# Altium project Artix7BasedBatDetector.PrjPcb
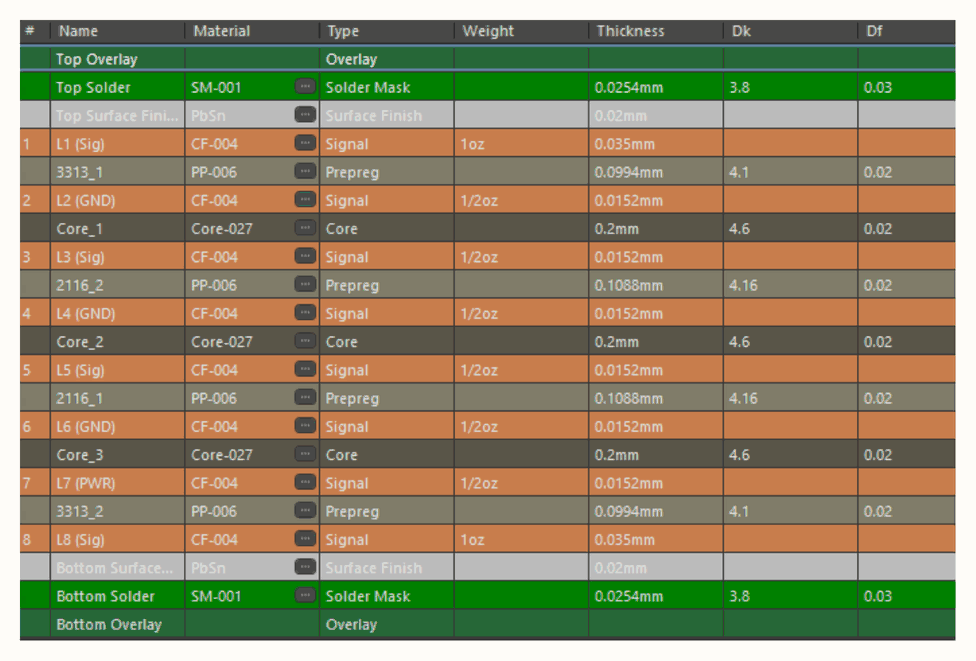
[diagram p0: ImpedanceControl.SchDoc]
11 sheets, 232 parts. Net scope: global (net labels, ports and power ports of the same name join across sheets).
Board file: PCBDesign.PcbDoc
Sheets:
  ImpedanceControl.SchDoc
  PowerSupplies.SchDoc
  FPGADecoupling.SchDoc
  FPGAConfig.SchDoc
  FTDIJtagConversion.SchDoc
  USBULPI.SchDoc
  FPGABank1X.SchDoc
  FPGABank3X.SchDoc
  DDR2Module.SchDoc
  AudioADC.SchDoc
  AnalogFrontend.SchDoc

## Sheet ImpedanceControl.SchDoc
size A4; SheetNumber: 1; SheetTotal: 11

## Sheet PowerSupplies.SchDoc
size A4; SheetNumber: 1; SheetTotal: 10
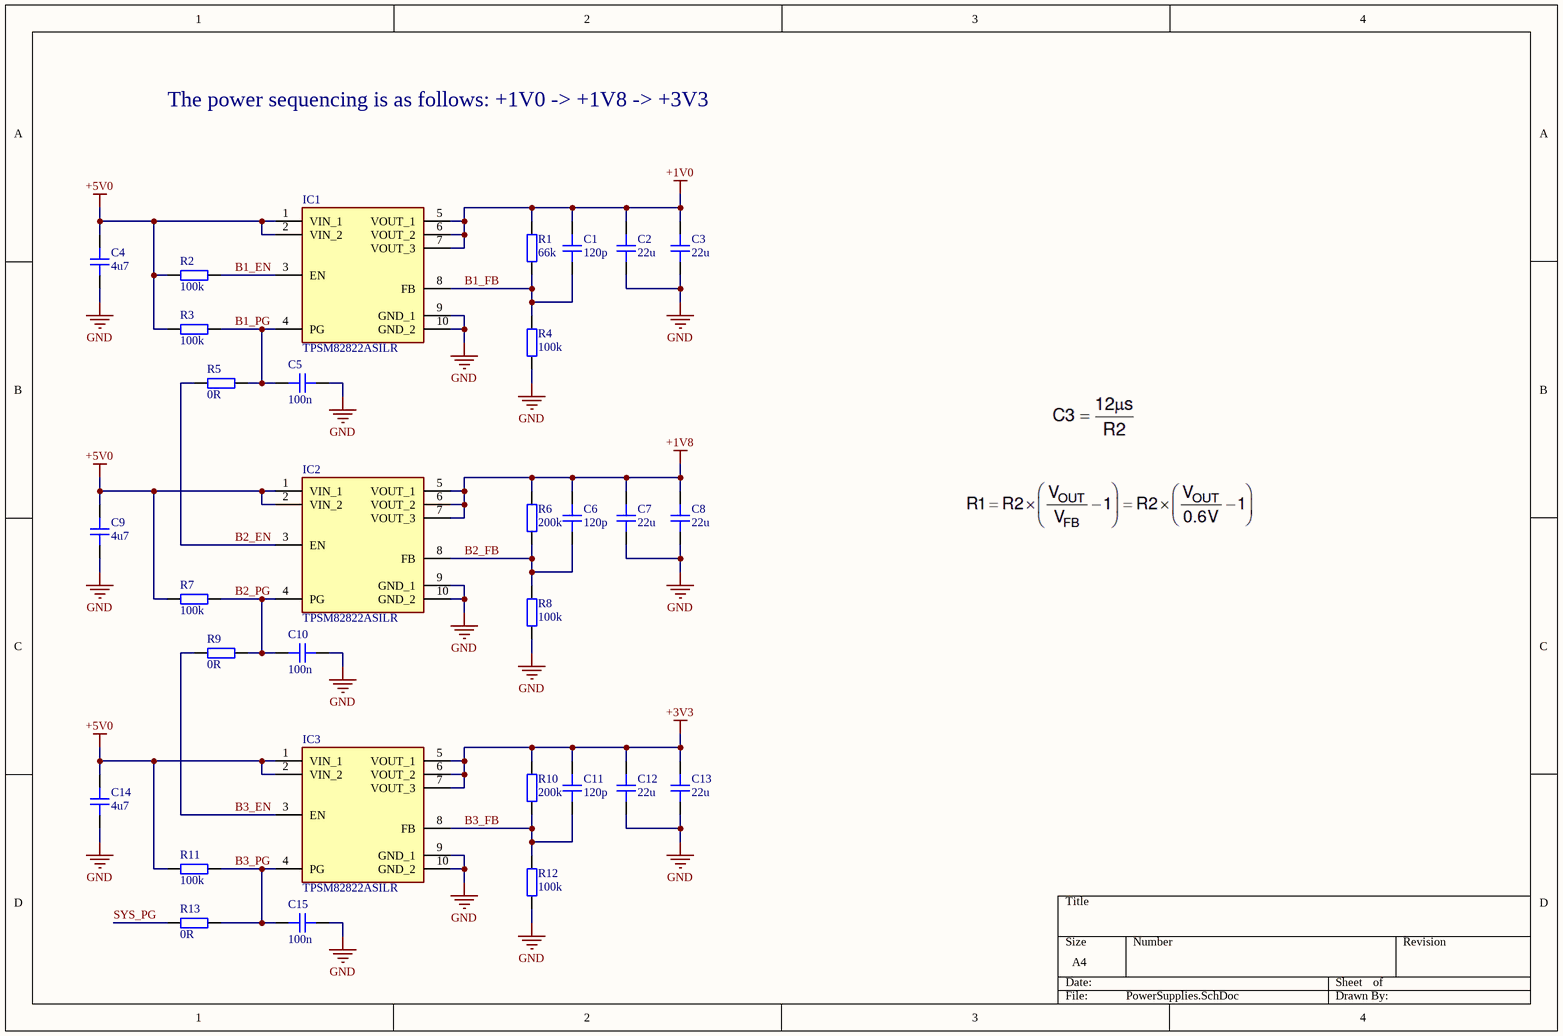
[diagram p1: PowerSupplies.SchDoc]

### Parts
C1  120p  [CAP_0402]
C2  22u  [CAP_0603]
C3  22u  [CAP_0603]
C4  4u7  [CAP_0402]
C5  100n  [CAP_0402]
C6  120p  [CAP_0402]
C7  22u  [CAP_0603]
C8  22u  [CAP_0603]
C9  4u7  [CAP_0402]
C10  100n  [CAP_0402]
C11  120p  [CAP_0402]
C12  22u  [CAP_0603]
C13  22u  [CAP_0603]
C14  4u7  [CAP_0402]
C15  100n  [CAP_0402]
IC1  TPSM82822ASILR  [TPSM82822ASILR]
IC2  TPSM82822ASILR  [TPSM82822ASILR]
IC3  TPSM82822ASILR  [TPSM82822ASILR]
R1  66k  [RES_0402]
R2  100k  [RES_0402]
R3  100k  [RES_0402]
R4  100k  [RES_0402]
R5  0R  [RES_0402]
R6  200k  [RES_0402]
R7  100k  [RES_0402]
R8  100k  [RES_0402]
R9  0R  [RES_0402]
R10  200k  [RES_0402]
R11  100k  [RES_0402]
R12  100k  [RES_0402]
R13  0R  [RES_0402]

### Nets
+1V0: C1.2 C2.2 C3.2 IC1.5(VOUT_1) IC1.6(VOUT_2) IC1.7(VOUT_3) R1.2
+1V8: C6.2 C7.2 C8.2 IC2.5(VOUT_1) IC2.6(VOUT_2) IC2.7(VOUT_3) R6.2
+3V3: C11.2 C12.2 C13.2 IC3.5(VOUT_1) IC3.6(VOUT_2) IC3.7(VOUT_3) R10.2
+5V0: C4.2 C9.2 C14.2 IC1.1(VIN_1) IC1.2(VIN_2) IC2.1(VIN_1) IC2.2(VIN_2) IC3.1(VIN_1) IC3.2(VIN_2) R2.1 R3.1 R7.1 R11.1
GND: C2.1 C3.1 C4.1 C5.1 C7.1 C8.1 C9.1 C10.1 C12.1 C13.1 C14.1 C15.1 IC1.9(GND_1) IC1.10(GND_2) IC2.9(GND_1) IC2.10(GND_2) IC3.9(GND_1) IC3.10(GND_2) R4.1 R8.1 R12.1
B1_EN: IC1.3(EN) R2.2
B1_FB: C1.1 IC1.8(FB) R1.1 R4.2
B1_PG: C5.2 IC1.4(PG) R3.2 R5.2
B2_EN: IC2.3(EN) R5.1
B2_FB: C6.1 IC2.8(FB) R6.1 R8.2
B2_PG: C10.2 IC2.4(PG) R7.2 R9.2
B3_EN: IC3.3(EN) R9.1
B3_FB: C11.1 IC3.8(FB) R10.1 R12.2
B3_PG: C15.2 IC3.4(PG) R11.2 R13.2
SYS_PG: R13.1

### Notes on the sheet
- The power sequencing is as follows: +1V0 -> +1V8 -> +3V3

### Library data of the parts
C1 C4-C6 C9-C11 C14 C15 = CAP_0402: Capacitor SMD 0402; Manufacturer: *; Manufacturer Part Number: *; Distributor Link: *; LCSC: *; Rating: *; Dielectric: *
C2 C3 C7 C8 C12 C13 = CAP_0603: Capacitor SMD 0603; Manufacturer: *; Manufacturer Part Number: *; Distributor Link: *; LCSC: *; Rating: *; Dielectric: *
IC1-IC3 = TPSM82822ASILR: Integrated Circuit; Manufacturer_Name: Texas Instruments; Datasheet Link: https://www.ti.com/lit/ds/symlink/tpsm82821a.pdf?ts=1639463145334&ref_url=https%253A%252F%252Fwww.ti.com%252Fsitesearch%252Fdocs%252Funiversalsearch.tsp%253FlangPref%253Den-US%2526searchTerm%253DTPSM82821ASILR%2526nr%253D8; Height: 1.1mm; Manufacturer_Part_Number: TPSM82822ASILR; Mouser Part Number: 595-TPSM82822ASILR; Mouser Price/Stock: https://www.mouser.co.uk/ProductDetail/Texas-Instruments/TPSM82822ASILR?qs=Rp5uXu7WBW%252BPqUf1%252BNZZyw%3D%3D; Arrow Part Number: TPSM82822ASILR; Arrow Price/Stock: https://www.arrow.com/en/products/tpsm82822asilr/texas-instruments?region=nac
R1-R13 = RES_0402: Resistor SMD 0402; Manufacturer: *; Manufacturer Part Number: *; Distributor Link: *; LCSC: *

## Sheet FPGADecoupling.SchDoc
size A4; SheetNumber: 2; SheetTotal: 10
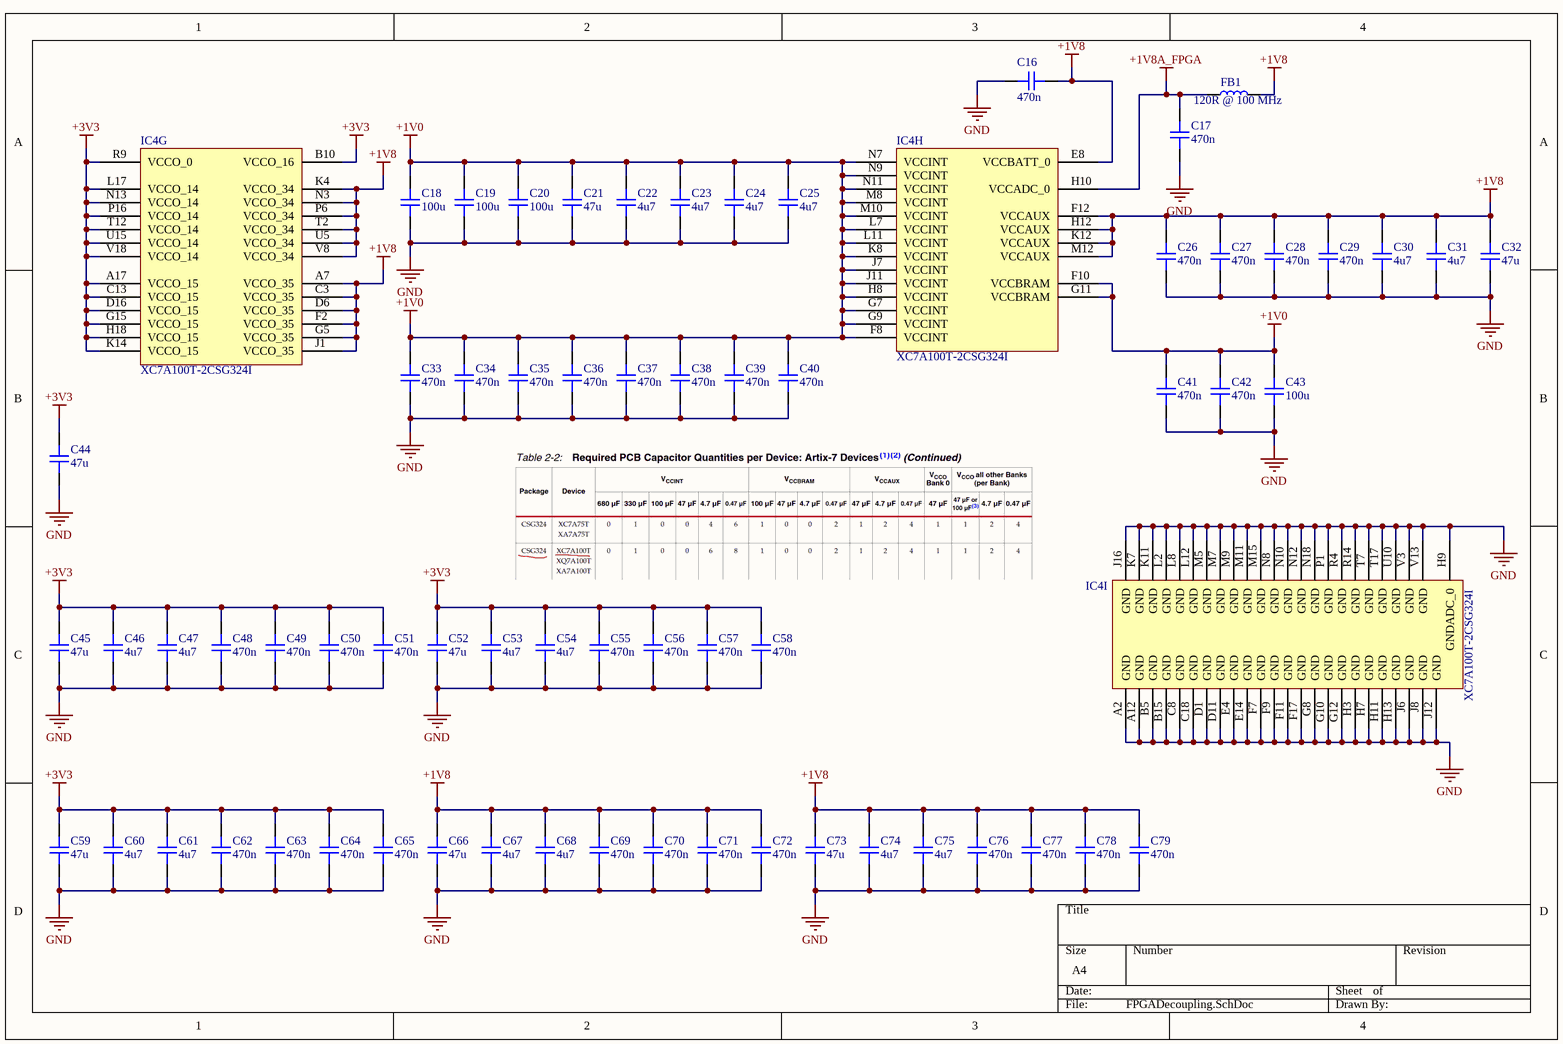
[diagram p2: FPGADecoupling.SchDoc]

### Parts
C16  470n  [CAP_0201]
C17  470n  [CAP_0201]
C18  100u  [CAP_0805]
C19  100u  [CAP_0805]
C20  100u  [CAP_0805]
C21  47u  [CAP_0603]
C22  4u7  [CAP_0402]
C23  4u7  [CAP_0402]
C24  4u7  [CAP_0402]
C25  4u7  [CAP_0402]
C26  470n  [CAP_0201]
C27  470n  [CAP_0201]
C28  470n  [CAP_0201]
C29  470n  [CAP_0201]
C30  4u7  [CAP_0402]
C31  4u7  [CAP_0402]
C32  47u  [CAP_0603]
C33  470n  [CAP_0201]
C34  470n  [CAP_0201]
C35  470n  [CAP_0201]
C36  470n  [CAP_0201]
C37  470n  [CAP_0201]
C38  470n  [CAP_0201]
C39  470n  [CAP_0201]
C40  470n  [CAP_0201]
C41  470n  [CAP_0201]
C42  470n  [CAP_0201]
C43  100u  [CAP_0805]
C44  47u  [CAP_0603]
C45  47u  [CAP_0603]
C46  4u7  [CAP_0402]
C47  4u7  [CAP_0402]
C48  470n  [CAP_0201]
C49  470n  [CAP_0201]
C50  470n  [CAP_0201]
C51  470n  [CAP_0201]
C52  47u  [CAP_0603]
C53  4u7  [CAP_0402]
C54  4u7  [CAP_0402]
C55  470n  [CAP_0201]
C56  470n  [CAP_0201]
C57  470n  [CAP_0201]
C58  470n  [CAP_0201]
C59  47u  [CAP_0603]
C60  4u7  [CAP_0402]
C61  4u7  [CAP_0402]
C62  470n  [CAP_0201]
C63  470n  [CAP_0201]
C64  470n  [CAP_0201]
C65  470n  [CAP_0201]
C66  47u  [CAP_0603]
C67  4u7  [CAP_0402]
C68  4u7  [CAP_0402]
C69  470n  [CAP_0201]
C70  470n  [CAP_0201]
C71  470n  [CAP_0201]
C72  470n  [CAP_0201]
C73  47u  [CAP_0603]
C74  4u7  [CAP_0402]
C75  4u7  [CAP_0402]
C76  470n  [CAP_0201]
C77  470n  [CAP_0201]
C78  470n  [CAP_0201]
C79  470n  [CAP_0201]
FB1  120R @ 100 MHz  [IND_0201]
IC4  XC7A100T-2CSG324I  [CSG324]  (parts G,H,I of 9)

### Nets
+1V0: C18.2 C19.2 C20.2 C21.2 C22.2 C23.2 C24.2 C25.2 C33.2 C34.2 C35.2 C36.2 C37.2 C38.2 C39.2 C40.2 C41.2 C42.2 C43.2 IC4.F8(VCCINT) IC4.F10(VCCBRAM) IC4.G7(VCCINT) IC4.G9(VCCINT) IC4.G11(VCCBRAM) IC4.H8(VCCINT) IC4.J7(VCCINT) IC4.J11(VCCINT) IC4.K8(VCCINT) IC4.L7(VCCINT) IC4.L11(VCCINT) IC4.M8(VCCINT) IC4.M10(VCCINT) IC4.N7(VCCINT) IC4.N9(VCCINT) IC4.N11(VCCINT)
+1V8: C16.2 C26.2 C27.2 C28.2 C29.2 C30.2 C31.2 C32.2 C66.2 C67.2 C68.2 C69.2 C70.2 C71.2 C72.2 C73.2 C74.2 C75.2 C76.2 C77.2 C78.2 C79.2 FB1.2 IC4.A7(VCCO_35) IC4.C3(VCCO_35) IC4.D6(VCCO_35) IC4.E8(VCCBATT_0) IC4.F2(VCCO_35) IC4.F12(VCCAUX) IC4.G5(VCCO_35) IC4.H12(VCCAUX) IC4.J1(VCCO_35) IC4.K4(VCCO_34) IC4.K12(VCCAUX) IC4.M12(VCCAUX) IC4.N3(VCCO_34) IC4.P6(VCCO_34) IC4.T2(VCCO_34) IC4.U5(VCCO_34) IC4.V8(VCCO_34)
+1V8A_FPGA: C17.2 FB1.1 IC4.H10(VCCADC_0)
+3V3: C44.2 C45.2 C46.2 C47.2 C48.2 C49.2 C50.2 C51.2 C52.2 C53.2 C54.2 C55.2 C56.2 C57.2 C58.2 C59.2 C60.2 C61.2 C62.2 C63.2 C64.2 C65.2 IC4.A17(VCCO_15) IC4.B10(VCCO_16) IC4.C13(VCCO_15) IC4.D16(VCCO_15) IC4.G15(VCCO_15) IC4.H18(VCCO_15) IC4.K14(VCCO_15) IC4.L17(VCCO_14) IC4.N13(VCCO_14) IC4.P16(VCCO_14) IC4.R9(VCCO_0) IC4.T12(VCCO_14) IC4.U15(VCCO_14) IC4.V18(VCCO_14)
GND: C16.1 C17.1 C18.1 C19.1 C20.1 C21.1 C22.1 C23.1 C24.1 C25.1 C26.1 C27.1 C28.1 C29.1 C30.1 C31.1 C32.1 C33.1 C34.1 C35.1 C36.1 C37.1 C38.1 C39.1 C40.1 C41.1 C42.1 C43.1 C44.1 C45.1 C46.1 C47.1 C48.1 C49.1 C50.1 C51.1 C52.1 C53.1 C54.1 C55.1 C56.1 C57.1 C58.1 C59.1 C60.1 C61.1 C62.1 C63.1 C64.1 C65.1 C66.1 C67.1 C68.1 C69.1 C70.1 C71.1 C72.1 C73.1 C74.1 C75.1 C76.1 C77.1 C78.1 C79.1 IC4.A2(GND) IC4.A12(GND) IC4.B5(GND) IC4.B15(GND) IC4.C8(GND) IC4.C18(GND) IC4.D1(GND) IC4.D11(GND) IC4.E4(GND) IC4.E14(GND) IC4.F7(GND) IC4.F9(GND) IC4.F11(GND) IC4.F17(GND) IC4.G8(GND) IC4.G10(GND) IC4.G12(GND) IC4.H3(GND) IC4.H7(GND) IC4.H9(GNDADC_0) IC4.H11(GND) IC4.H13(GND) IC4.J6(GND) IC4.J8(GND) IC4.J12(GND) IC4.J16(GND) IC4.K7(GND) IC4.K11(GND) IC4.L2(GND) IC4.L8(GND) IC4.L12(GND) IC4.M5(GND) IC4.M7(GND) IC4.M9(GND) IC4.M11(GND) IC4.M15(GND) IC4.N8(GND) IC4.N10(GND) IC4.N12(GND) IC4.N18(GND) IC4.P1(GND) IC4.R4(GND) IC4.R14(GND) IC4.T7(GND) IC4.T17(GND) IC4.U10(GND) IC4.V3(GND) IC4.V13(GND)

### Library data of the parts
C16 C17 C26-C29 C33-C42 C48-C51 C55-C58 C62-C65 C69-C72 C76-C79 = CAP_0201: Capacitor SMD 0201; Manufacturer: *; Manufacturer Part Number: *; Distributor Link: *; LCSC: *; Rating: *; Dielectric: *
C18-C20 C43 = CAP_0805: Capacitor SMD 0805; Manufacturer: *; Manufacturer Part Number: *; Distributor Link: *; LCSC: *; Rating: *; Dielectric: *
C21 C32 C44 C45 C52 C59 C66 C73 = CAP_0603: Capacitor SMD 0603; Manufacturer: *; Manufacturer Part Number: *; Distributor Link: *; LCSC: *; Rating: *; Dielectric: *
C22-C25 C30 C31 C46 C47 C53 C54 C60 C61 C67 C68 C74 C75 = CAP_0402: Capacitor SMD 0402; Manufacturer: *; Manufacturer Part Number: *; Distributor Link: *; LCSC: *; Rating: *; Dielectric: *
FB1 = IND_0201: Inductor SMD 0201; Manufacturer_Name: Murata Electronics; Manufacturer_Part_Number: LQP03HQ56NH02D; Datasheet Link: https://psearch.en.murata.com/inductor/product/LQP03HQ56NH02%23.html; Height: 0.42mm; Mouser Part Number: 81-LQP03HQ56NH02D; Mouser Price/Stock: https://www.mouser.co.uk/ProductDetail/Murata-Electronics/LQP03HQ56NH02D?qs=B6kkDfuK7%2FBQu1Ob9%2FT2Bg%3D%3D
IC4 = XC7A100T-2CSG324I: Artix-7 FPGA, 210 User I/Os, 0 GTP, 324-Ball BGA, Speed Grade 2, Industrial Grade, Pb-Free; Manufacturer: Xilinx; Logic Cells: 101440; DSP48E1 Slices: 240; Block RAM Blocks (Max Kb): 4860; Clock Mgmt Tiles (CMTs): 6; Max User I/O: 300; CLBs (Slices): 15850; Block RAM Blocks (18Kb): 270; Speed Grade: -2; Block RAM Blocks (36Kb): 135; ComponentLink1Description: Datasheet; ComponentLink3Description: DC and Switching Characteristics; Generic Part Number: XC7A100T; RoHS: Pb-Free; Mounting Technology: Surface Mount; PackageReference: CSG324; ComponentLink4URL: http://www.xilinx.com/support/packagefiles/a7packages/xc7a100tcsg324pkg.txt; NexusDeviceID: XC7A100T-2CSG324I; PackageVersion: Rev 1.8; PartNumber: XC7A100T-2CSG324I; CLBs (Max Distributed RAM Kb): 1188; Code_JEDEC: MO-275-KKAC-1; ComponentLink2Description: Package Specification; ComponentLink1URL: http://www.xilinx.com/support/documentation/data_sheets/ds180_7Series_Overview.pdf; ComponentLink3URL: http://www.xilinx.com/support/documentation/data_sheets/ds181_Artix_7_Data_Sheet.pdf; ComponentLink5URL: http://www.xilinx.com/support/documentation/user_guides/ug475_7Series_Pkg_Pinout.pdf; PackageDescription: Wire-Bond Chip-Scale BGA, Body 15 x 15 mm, 0.8 mm Pitch; ComponentLink4Description: Package File; DatasheetVersion: v1.12; ComponentLink2URL: http://www.xilinx.com/support/documentation/user_guides/ug475_7Series_Pkg_Pinout.pdf; ComponentLink5Description: Packaging and Pinout

## Sheet FPGAConfig.SchDoc
size A4; SheetNumber: 3; SheetTotal: 10
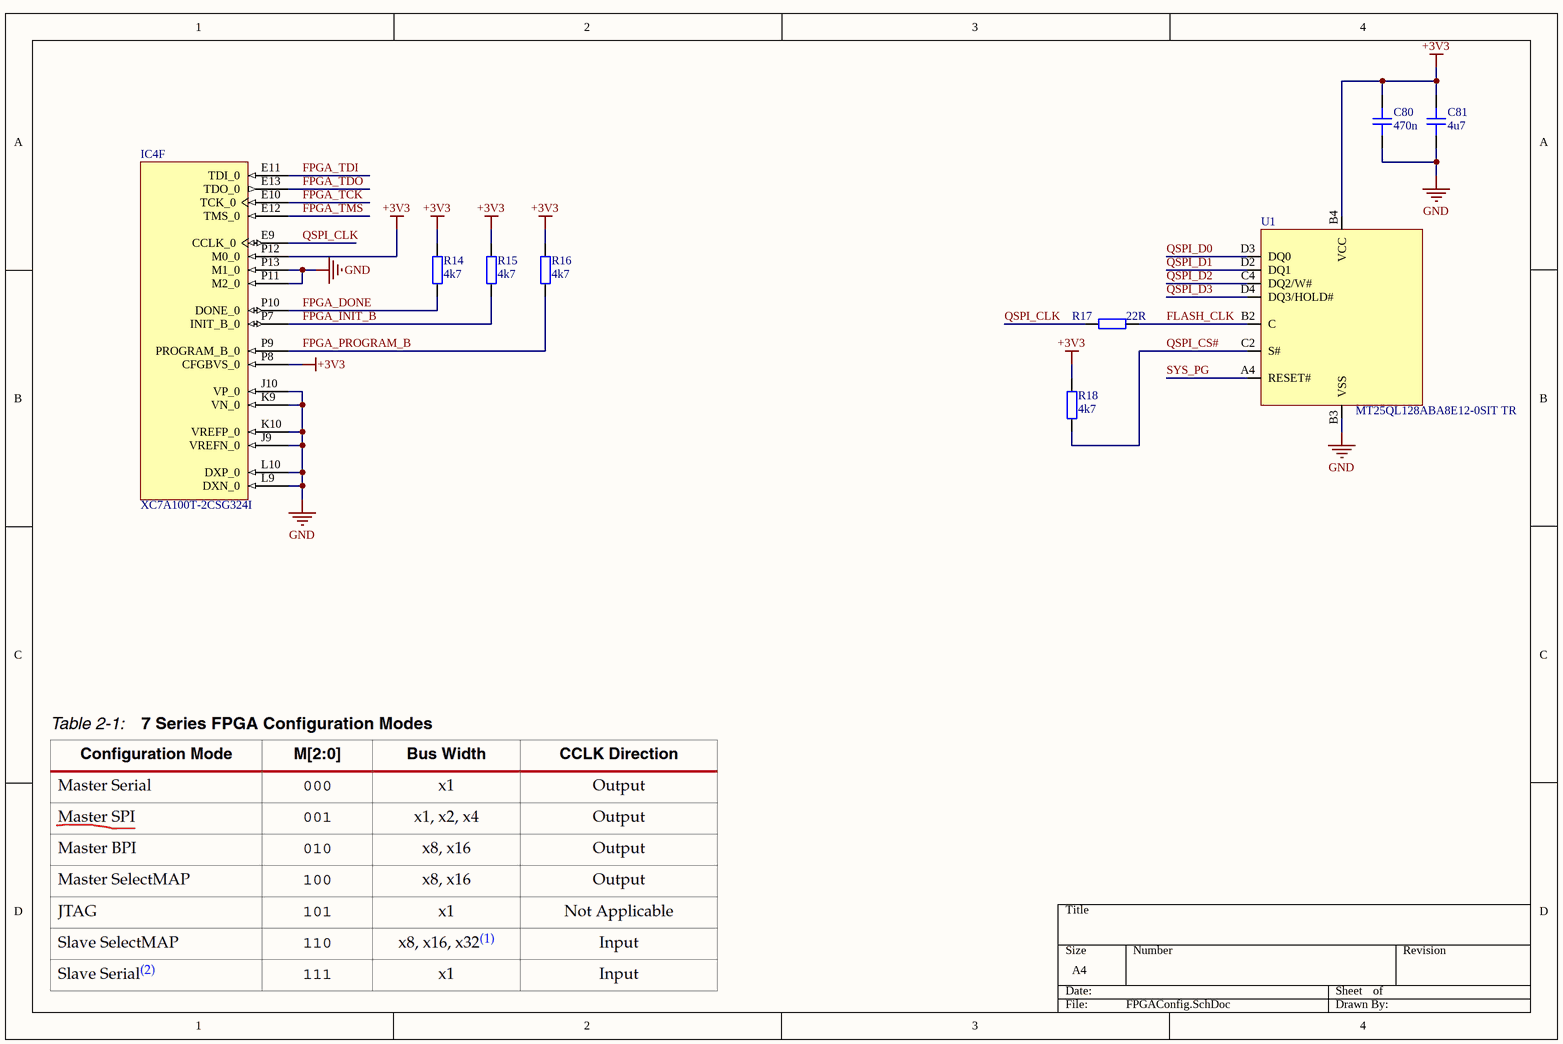
[diagram p3: FPGAConfig.SchDoc]

### Parts
C80  470n  [CAP_0201]
C81  4u7  [CAP_0402]
IC4  XC7A100T-2CSG324I  [CSG324]  (part F of 9)
R14  4k7  [RES_0201]
R15  4k7  [RES_0201]
R16  4k7  [RES_0201]
R17  22R  [RES_0201]
R18  4k7  [RES_0201]
U1  MT25QL128ABA8E12-0SIT TR  [T-PBGA-5x5-6x8-24]

### Nets
+3V3: C80.2 C81.2 IC4.P8(CFGBVS_0) IC4.P12(M0_0) R14.2 R15.2 R16.2 R18.2 U1.B4(VCC)
GND: C80.1 C81.1 IC4.J9(VREFN_0) IC4.J10(VP_0) IC4.K9(VN_0) IC4.K10(VREFP_0) IC4.L9(DXN_0) IC4.L10(DXP_0) IC4.P11(M2_0) IC4.P13(M1_0) U1.B3(VSS)
FLASH_CLK: R17.1 U1.B2(C)
FPGA_DONE: IC4.P10(DONE_0) R14.1
FPGA_INIT_B: IC4.P7(INIT_B_0) R15.1
FPGA_PROGRAM_B: IC4.P9(PROGRAM_B_0) R16.1
FPGA_TCK: IC4.E10(TCK_0)
FPGA_TDI: IC4.E11(TDI_0)
FPGA_TDO: IC4.E13(TDO_0)
FPGA_TMS: IC4.E12(TMS_0)
QSPI_CLK: IC4.E9(CCLK_0) R17.2
QSPI_CS#: R18.1 U1.C2(S#)
QSPI_D0: U1.D3(DQ0)
QSPI_D1: U1.D2(DQ1)
QSPI_D2: U1.C4(DQ2/W#)
QSPI_D3: U1.D4(DQ3/HOLD#)
SYS_PG: U1.A4(RESET#)

### Library data of the parts
C80 = CAP_0201: Capacitor SMD 0201; Manufacturer: *; Manufacturer Part Number: *; Distributor Link: *; LCSC: *; Rating: *; Dielectric: *
C81 = CAP_0402: Capacitor SMD 0402; Manufacturer: *; Manufacturer Part Number: *; Distributor Link: *; LCSC: *; Rating: *; Dielectric: *
IC4 = XC7A100T-2CSG324I: as IC4 on sheet FPGADecoupling; ComponentLink1Description: Datasheet; ComponentLink3Description: DC and Switching Characteristics; Generic Part Number: XC7A100T; RoHS: Pb-Free; Mounting Technology: Surface Mount; PackageReference: CSG324; ComponentLink4URL: http://www.xilinx.com/support/packagefiles/a7packages/xc7a100tcsg324pkg.txt; NexusDeviceID: XC7A100T-2CSG324I; PackageVersion: Rev 1.8; PartNumber: XC7A100T-2CSG324I; CLBs (Max Distributed RAM Kb): 1188; Code_JEDEC: MO-275-KKAC-1; ComponentLink2Description: Package Specification; ComponentLink1URL: http://www.xilinx.com/support/documentation/data_sheets/ds180_7Series_Overview.pdf; ComponentLink3URL: http://www.xilinx.com/support/documentation/data_sheets/ds181_Artix_7_Data_Sheet.pdf; ComponentLink5URL: http://www.xilinx.com/support/documentation/user_guides/ug475_7Series_Pkg_Pinout.pdf; PackageDescription: Wire-Bond Chip-Scale BGA, Body 15 x 15 mm, 0.8 mm Pitch; ComponentLink4Description: Package File; DatasheetVersion: v1.12; ComponentLink2URL: http://www.xilinx.com/support/documentation/user_guides/ug475_7Series_Pkg_Pinout.pdf; ComponentLink5Description: Packaging and Pinout
R14-R18 = RES_0201: Resistor SMD 0201; Manufacturer: *; Manufacturer Part Number: *; Distributor Link: *; LCSC: *
U1 = MT25QL128ABA8E12-0SIT: NOR Flash QSPI 128 Mbit T-PBGA-24; Manufacturer: Micron Technology; Manufacturer Part Number: MT25QL128ABA8E12-0SIT TR

## Sheet FTDIJtagConversion.SchDoc
size A4; SheetNumber: 4; SheetTotal: 10
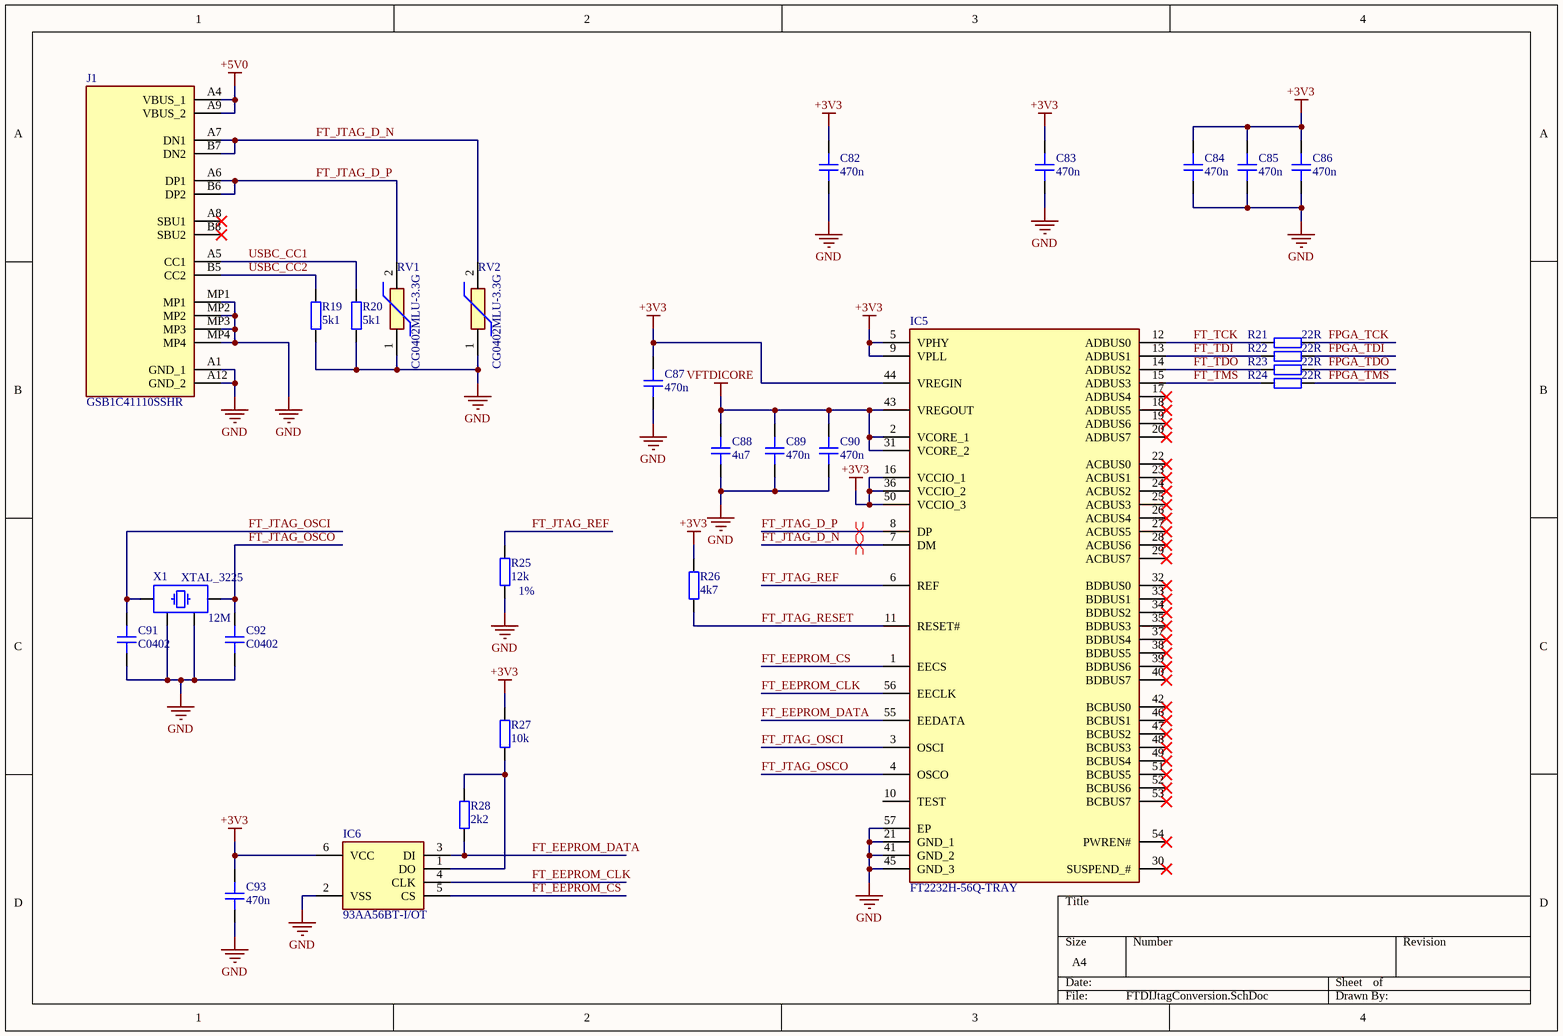
[diagram p4: FTDIJtagConversion.SchDoc]

### Parts
C82  470n  [CAP_0201]
C83  470n  [CAP_0201]
C84  470n  [CAP_0201]
C85  470n  [CAP_0201]
C86  470n  [CAP_0201]
C87  470n  [CAP_0201]
C88  4u7  [CAP_0402]
C89  470n  [CAP_0201]
C90  470n  [CAP_0201]
C91  C0402  [CAP_0402]
C92  C0402  [CAP_0402]
C93  470n  [CAP_0201]
IC5  FT2232H-56Q-TRAY  [QFN50P800X800X100-57N-D]
IC6  93AA56BT-I/OT  [SOT95P270X145-6N]
J1  GSB1C41110SSHR  [GSB1C41110SSHR]
R19  5k1  [RES_0402]
R20  5k1  [RES_0402]
R21  22R  [RES_0201]
R22  22R  [RES_0201]
R23  22R  [RES_0201]
R24  22R  [RES_0201]
R25  12k  [RES_0402]
R26  4k7  [RES_0201]
R27  10k  [RES_0402]
R28  2k2  [RES_0402]
RV1  CG0402MLU-3.3G  [VARC1005X41N]
RV2  CG0402MLU-3.3G  [VARC1005X41N]
X1  XTAL_3225  [XTAL_3225]

### Nets
+3V3: C82.2 C83.2 C84.2 C85.2 C86.2 C87.2 C93.2 IC5.5(VPHY) IC5.9(VPLL) IC5.16(VCCIO_1) IC5.36(VCCIO_2) IC5.44(VREGIN) IC5.50(VCCIO_3) IC6.6(VCC) R26.2 R27.2
+5V0: J1.A4(VBUS_1) J1.A9(VBUS_2)
GND: C82.1 C83.1 C84.1 C85.1 C86.1 C87.1 C88.1 C89.1 C90.1 C91.1 C92.1 C93.1 IC5.21(GND_1) IC5.41(GND_2) IC5.45(GND_3) IC5.57(EP) IC6.2(VSS) J1.A1(GND_1) J1.A12(GND_2) J1.MP1 J1.MP2 J1.MP3 J1.MP4 R19.1 R20.1 R25.1 RV1.1 RV2.1 X1.2 X1.4
VFTDICORE: C88.2 C89.2 C90.2 IC5.2(VCORE_1) IC5.31(VCORE_2) IC5.43(VREGOUT)
FPGA_TCK: R21.1
FPGA_TDI: R22.1
FPGA_TDO: R23.1
FPGA_TMS: R24.1
FT_EEPROM_CLK: IC5.56(EECLK) IC6.4(CLK)
FT_EEPROM_CS: IC5.1(EECS) IC6.5(CS)
FT_EEPROM_DATA: IC5.55(EEDATA) IC6.3(DI) R28.1
FT_JTAG_D_N: IC5.7(DM) J1.A7(DN1) J1.B7(DN2) RV2.2
FT_JTAG_D_P: IC5.8(DP) J1.A6(DP1) J1.B6(DP2) RV1.2
FT_JTAG_OSCI: C91.2 IC5.3(OSCI) X1.1
FT_JTAG_OSCO: C92.2 IC5.4(OSCO) X1.3
FT_JTAG_REF: IC5.6(REF) R25.2
FT_JTAG_RESET: IC5.11(RESET#) R26.1
FT_TCK: IC5.12(ADBUS0) R21.2
FT_TDI: IC5.13(ADBUS1) R22.2
FT_TDO: IC5.14(ADBUS2) R23.2
FT_TMS: IC5.15(ADBUS3) R24.2
USBC_CC1: J1.A5(CC1) R20.2
USBC_CC2: J1.B5(CC2) R19.2
NetIC6_1: IC6.1(DO) R27.1 R28.2

Not connected (* = marked no-connect by the designer): IC5 10(TEST) 17(ADBUS4)* 18(ADBUS5)* 19(ADBUS6)* 20(ADBUS7)* 22(ACBUS0)* 23(ACBUS1)* 24(ACBUS2)* 25(ACBUS3)* 26(ACBUS4)* 27(ACBUS5)* 28(ACBUS6)* 29(ACBUS7)* 30(SUSPEND_#)* 32(BDBUS0)* 33(BDBUS1)* 34(BDBUS2)* 35(BDBUS3)* 37(BDBUS4)* 38(BDBUS5)* 39(BDBUS6)* 40(BDBUS7)* 42(BCBUS0)* 46(BCBUS1)* 47(BCBUS2)* 48(BCBUS3)* 49(BCBUS4)* 51(BCBUS5)* 52(BCBUS6)* 53(BCBUS7)* 54(PWREN#)*; J1 A8(SBU1)* B8(SBU2)*

### Layout directives
differential pair: FT_JTAG_D_N, FT_JTAG_D_P

### Notes on the sheet
- (near X1) 12M
- (near R25) 1%

### Library data of the parts
C82-C87 C89 C90 C93 = CAP_0201: Capacitor SMD 0201; Manufacturer: *; Manufacturer Part Number: *; Distributor Link: *; LCSC: *; Rating: *; Dielectric: *
C88 C91 C92 = CAP_0402: Capacitor SMD 0402; Manufacturer: *; Manufacturer Part Number: *; Distributor Link: *; LCSC: *; Rating: *; Dielectric: *
IC5 = FT2232H-56Q-TRAY: Integrated Circuit; Manufacturer_Name: FTDI Chip; Datasheet Link: https://componentsearchengine.com/Datasheets/1/FT2232H-56Q-TRAY.pdf; Height: 1mm; Manufacturer_Part_Number: FT2232H-56Q-TRAY; Mouser Part Number: 895-FT2232H-56Q-TRAY; Mouser Price/Stock: https://www.mouser.co.uk/ProductDetail/FTDI/FT2232H-56Q-TRAY?qs=u4lROS522ZW4g0YyKZT0kg%3D%3D; Arrow Part Number: FT2232H-56Q-TRAY; Arrow Price/Stock: null?region=nac
IC6 = 93AA56BT-I/OT: EEPROM; Manufacturer_Name: Microchip; Datasheet Link: http://ww1.microchip.com/downloads/en/DeviceDoc/21794G.pdf; Height: 1.45mm; Manufacturer_Part_Number: 93AA56BT-I/OT; Mouser Part Number: 579-93AA56BT-I/OT; Mouser Price/Stock: https://www.mouser.co.uk/ProductDetail/Microchip-Technology/93AA56BT-I-OT?qs=hul3WK2zl4p%252B6%2FsdRU7j4A%3D%3D; Arrow Part Number: 93AA56BT-I/OT; Arrow Price/Stock: https://www.arrow.com/en/products/93aa56bt-iot/microchip-technology
J1 = GSB1C41110SSHR: Connector; Manufacturer_Name: Amphenol Communications Solutions; Datasheet Link: https://cdn.amphenol-cs.com/media/wysiwyg/files/drawing/gsb1c41x10sshr-ax1.pdf; Height: 3.41mm; Manufacturer_Part_Number: GSB1C41110SSHR
R19 R20 R25 R27 R28 = RES_0402: Resistor SMD 0402; Manufacturer: *; Manufacturer Part Number: *; Distributor Link: *; LCSC: *
R21-R24 R26 = RES_0201: Resistor SMD 0201; Manufacturer: *; Manufacturer Part Number: *; Distributor Link: *; LCSC: *
RV1 RV2 = CG0402MLU-3.3G: ESD Diode; Manufacturer_Name: Bourns; Datasheet Link: https://www.bourns.com/docs/Product-Datasheets/MLU.pdf; Height: 0.41mm; Manufacturer_Part_Number: CG0402MLU-3.3G; Mouser Part Number: 652-CG0402MLU-3.3G; Mouser Price/Stock: https://www.mouser.co.uk/ProductDetail/Bourns/CG0402MLU-3.3G?qs=m8myXnDJXpWVM8EQWErxtQ%3D%3D; Arrow Part Number: CG0402MLU-3.3G; Arrow Price/Stock: https://www.arrow.com/en/products/cg0402mlu-3.3g/bourns?utm_currency=USD&region=nac
X1 = XTAL_3225: Crystal SMD 3225; Distributor Link: *

## Sheet USBULPI.SchDoc
size A4; SheetNumber: 5; SheetTotal: 10
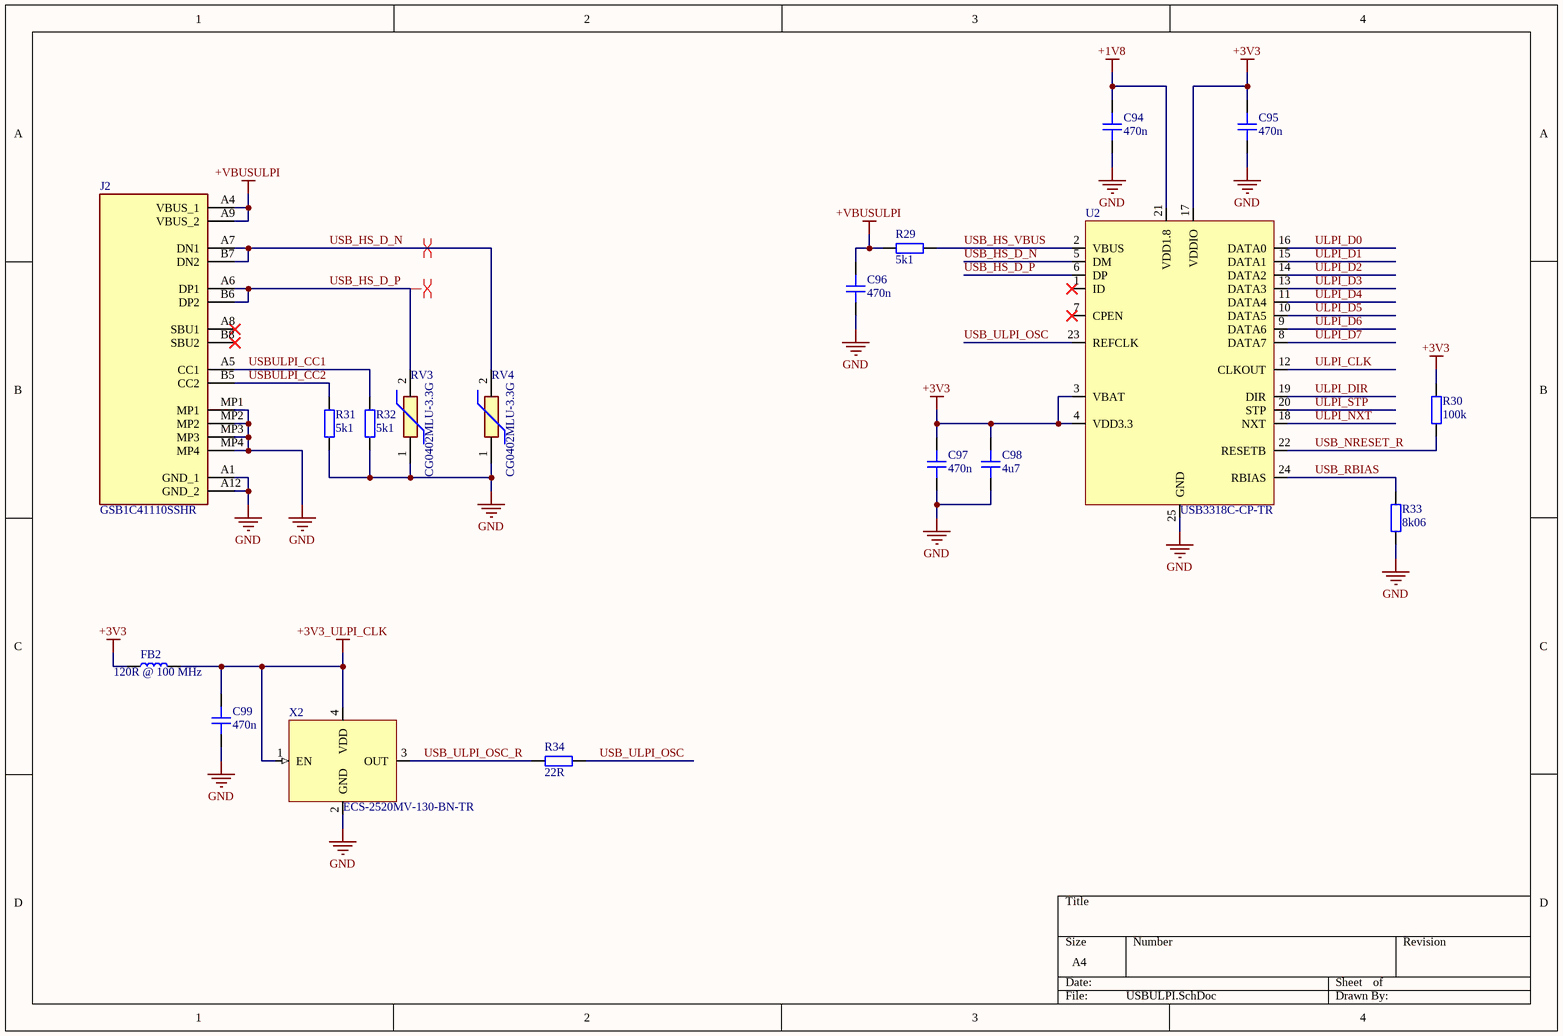
[diagram p5: USBULPI.SchDoc]

### Parts
C94  470n  [CAP_0201]
C95  470n  [CAP_0201]
C96  470n  [CAP_0201]
C97  470n  [CAP_0201]
C98  4u7  [CAP_0402]
C99  470n  [CAP_0201]
FB2  120R @ 100 MHz  [IND_0201]
J2  GSB1C41110SSHR  [GSB1C41110SSHR]
R29  5k1  [RES_0402]
R30  100k  [RES_0402]
R31  5k1  [RES_0402]
R32  5k1  [RES_0402]
R33  8k06  [RES_0402]
R34  22R  [RES_0201]
RV3  CG0402MLU-3.3G  [VARC1005X41N]
RV4  CG0402MLU-3.3G  [VARC1005X41N]
U2  USB3318C-CP-TR  [QFN50P400X400X100-25N-D]
X2  ECS-2520MV-130-BN-TR  [XTAL_2520]

### Nets
+1V8: C94.2 U2.21(VDD1.8)
+3V3: C95.2 C97.2 C98.2 FB2.1 R30.2 U2.3(VBAT) U2.4(VDD3.3) U2.17(VDDIO)
+3V3_ULPI_CLK: C99.2 FB2.2 X2.1(EN) X2.4(VDD)
+VBUSULPI: C96.2 J2.A4(VBUS_1) J2.A9(VBUS_2) R29.2
GND: C94.1 C95.1 C96.1 C97.1 C98.1 C99.1 J2.A1(GND_1) J2.A12(GND_2) J2.MP1 J2.MP2 J2.MP3 J2.MP4 R31.1 R32.1 R33.1 RV3.1 RV4.1 U2.25(GND) X2.2(GND)
ULPI_CLK: U2.12(CLKOUT)
ULPI_D0: U2.16(DATA0)
ULPI_D1: U2.15(DATA1)
ULPI_D2: U2.14(DATA2)
ULPI_D3: U2.13(DATA3)
ULPI_D4: U2.11(DATA4)
ULPI_D5: U2.10(DATA5)
ULPI_D6: U2.9(DATA6)
ULPI_D7: U2.8(DATA7)
ULPI_DIR: U2.19(DIR)
ULPI_NXT: U2.18(NXT)
ULPI_STP: U2.20(STP)
USB_HS_D_N: J2.A7(DN1) J2.B7(DN2) RV4.2 U2.5(DM)
USB_HS_D_P: J2.A6(DP1) J2.B6(DP2) RV3.2 U2.6(DP)
USB_HS_VBUS: R29.1 U2.2(VBUS)
USB_NRESET_R: R30.1 U2.22(RESETB)
USB_RBIAS: R33.2 U2.24(RBIAS)
USB_ULPI_OSC: R34.2 U2.23(REFCLK)
USB_ULPI_OSC_R: R34.1 X2.3(OUT)
USBULPI_CC1: J2.A5(CC1) R32.2
USBULPI_CC2: J2.B5(CC2) R31.2

Not connected (* = marked no-connect by the designer): J2 A8(SBU1)* B8(SBU2)*; U2 1(ID)* 7(CPEN)*

### Layout directives
differential pair: USB_HS_D_N, USB_HS_D_P

### Library data of the parts
C94-C97 C99 = CAP_0201: Capacitor SMD 0201; Manufacturer: *; Manufacturer Part Number: *; Distributor Link: *; LCSC: *; Rating: *; Dielectric: *
C98 = CAP_0402: Capacitor SMD 0402; Manufacturer: *; Manufacturer Part Number: *; Distributor Link: *; LCSC: *; Rating: *; Dielectric: *
FB2 = IND_0201: as FB1 on sheet FPGADecoupling; Datasheet Link: https://psearch.en.murata.com/inductor/product/LQP03HQ56NH02%23.html; Height: 0.42mm; Mouser Part Number: 81-LQP03HQ56NH02D; Mouser Price/Stock: https://www.mouser.co.uk/ProductDetail/Murata-Electronics/LQP03HQ56NH02D?qs=B6kkDfuK7%2FBQu1Ob9%2FT2Bg%3D%3D
J2 = GSB1C41110SSHR: as J1 on sheet FTDIJtagConversion; Datasheet Link: https://cdn.amphenol-cs.com/media/wysiwyg/files/drawing/gsb1c41x10sshr-ax1.pdf; Height: 3.41mm; Manufacturer_Part_Number: GSB1C41110SSHR
R29-R33 = RES_0402: Resistor SMD 0402; Manufacturer: *; Manufacturer Part Number: *; Distributor Link: *; LCSC: *
R34 = RES_0201: Resistor SMD 0201; Manufacturer: *; Manufacturer Part Number: *; Distributor Link: *; LCSC: *
RV3 RV4 = CG0402MLU-3.3G: ESD Diode; Manufacturer_Name: Bourns; Datasheet Link: https://www.bourns.com/docs/Product-Datasheets/MLU.pdf; Height: 0.41mm; Manufacturer_Part_Number: CG0402MLU-3.3G; Mouser Part Number: 652-CG0402MLU-3.3G; Mouser Price/Stock: https://www.mouser.co.uk/ProductDetail/Bourns/CG0402MLU-3.3G?qs=m8myXnDJXpWVM8EQWErxtQ%3D%3D; Arrow Part Number: CG0402MLU-3.3G; Arrow Price/Stock: https://www.arrow.com/en/products/cg0402mlu-3.3g/bourns?utm_currency=USD&region=nac
U2 = USB3318C-CP-TR: USB Interface IC High Speed USB 1.8V ULPI; Manufacturer: Microchip; Manufacturer Part Number: USB3318C-CP-TR
X2 = ECS-2520MV-130-BN-TR: Standard Clock Oscillators XO (Standard),13MHz,Standby (Power Down),CMOS, Multi-Volt,1.6 V 3.6 V,+/-50ppm,-40 C 85 C,6mA,Surface Mount,4-SMD, No Lead,(2.50mm x 2.00mm),(0.80mm); Manufacturer: ECS; Manufacturer Part Number: ECS-2520MV-130-BN-TR

## Sheet FPGABank1X.SchDoc
size A4; SheetNumber: 6; SheetTotal: 10
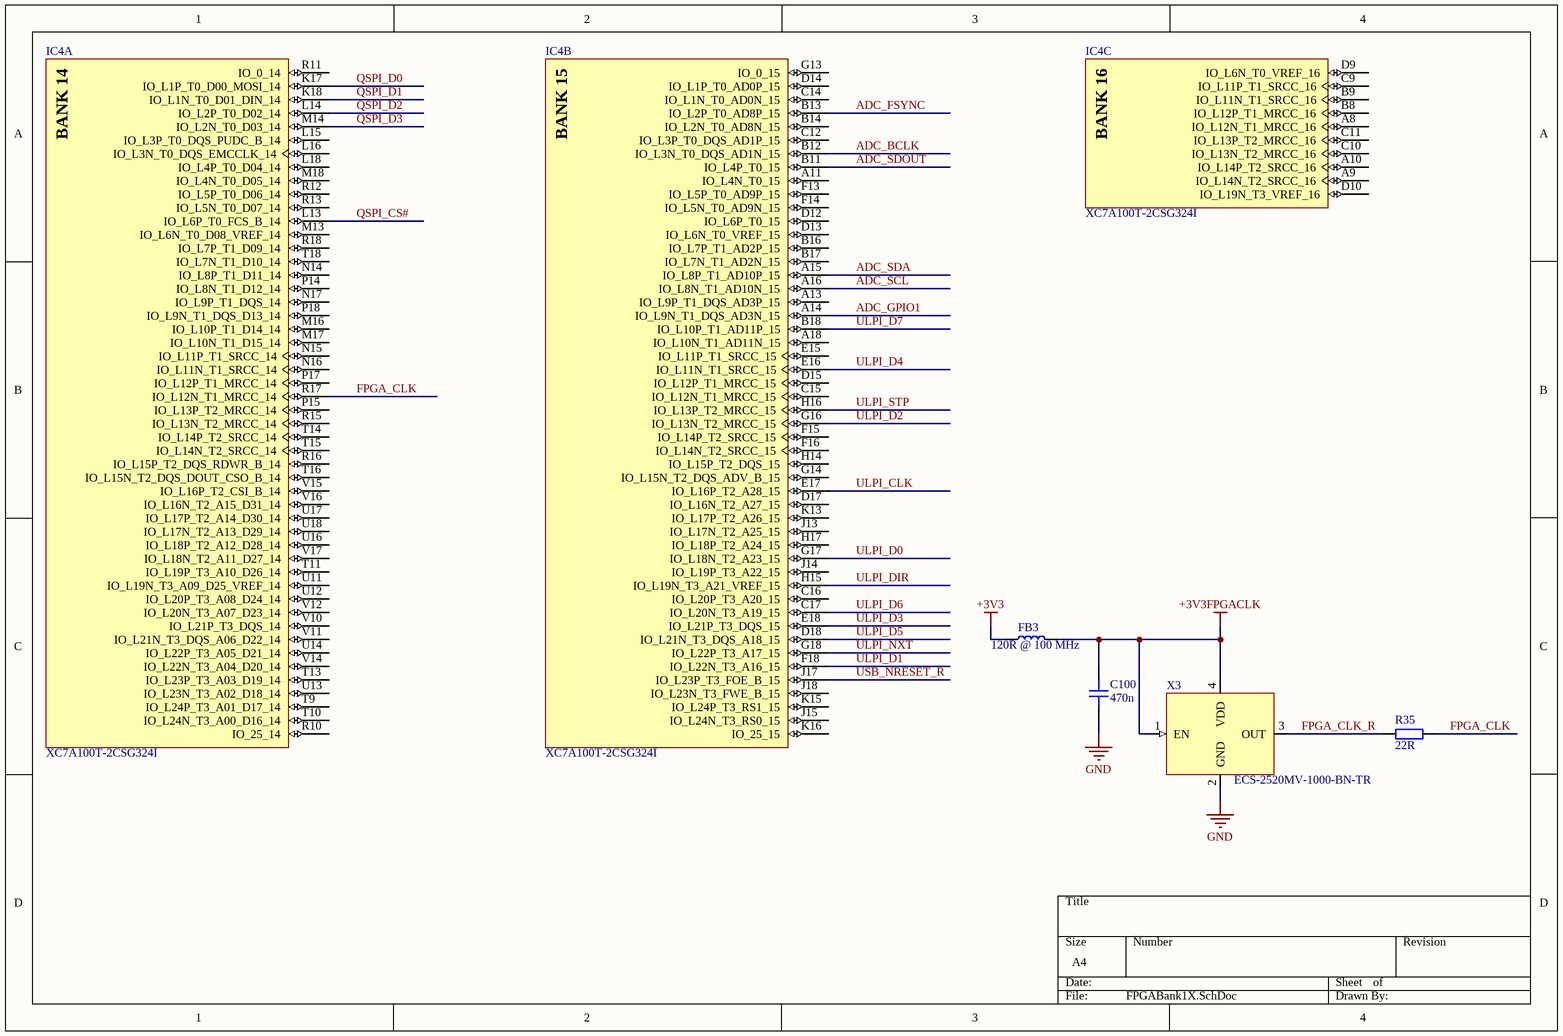
[diagram p6: FPGABank1X.SchDoc]

### Parts
C100  470n  [CAP_0201]
FB3  120R @ 100 MHz  [IND_0201]
IC4  XC7A100T-2CSG324I  [CSG324]  (parts A,B,C of 9)
R35  22R  [RES_0201]
X3  ECS-2520MV-1000-BN-TR  [XTAL_2520]

### Nets
+3V3: FB3.1
+3V3FPGACLK: C100.2 FB3.2 X3.1(EN) X3.4(VDD)
GND: C100.1 X3.2(GND)
ADC_BCLK: IC4.B12(IO_L3N_T0_DQS_AD1N_15)
ADC_FSYNC: IC4.B13(IO_L2P_T0_AD8P_15)
ADC_GPIO1: IC4.A14(IO_L9N_T1_DQS_AD3N_15)
ADC_SCL: IC4.A16(IO_L8N_T1_AD10N_15)
ADC_SDA: IC4.A15(IO_L8P_T1_AD10P_15)
ADC_SDOUT: IC4.B11(IO_L4P_T0_15)
FPGA_CLK: IC4.R17(IO_L12N_T1_MRCC_14) R35.2
FPGA_CLK_R: R35.1 X3.3(OUT)
QSPI_CS#: IC4.L13(IO_L6P_T0_FCS_B_14)
QSPI_D0: IC4.K17(IO_L1P_T0_D00_MOSI_14)
QSPI_D1: IC4.K18(IO_L1N_T0_D01_DIN_14)
QSPI_D2: IC4.L14(IO_L2P_T0_D02_14)
QSPI_D3: IC4.M14(IO_L2N_T0_D03_14)
ULPI_CLK: IC4.E17(IO_L16P_T2_A28_15)
ULPI_D0: IC4.G17(IO_L18N_T2_A23_15)
ULPI_D1: IC4.F18(IO_L22N_T3_A16_15)
ULPI_D2: IC4.G16(IO_L13N_T2_MRCC_15)
ULPI_D3: IC4.E18(IO_L21P_T3_DQS_15)
ULPI_D4: IC4.E16(IO_L11N_T1_SRCC_15)
ULPI_D5: IC4.D18(IO_L21N_T3_DQS_A18_15)
ULPI_D6: IC4.C17(IO_L20N_T3_A19_15)
ULPI_D7: IC4.B18(IO_L10P_T1_AD11P_15)
ULPI_DIR: IC4.H15(IO_L19N_T3_A21_VREF_15)
ULPI_NXT: IC4.G18(IO_L22P_T3_A17_15)
ULPI_STP: IC4.H16(IO_L13P_T2_MRCC_15)
USB_NRESET_R: IC4.J17(IO_L23P_T3_FOE_B_15)

Not connected (* = marked no-connect by the designer): IC4 A8(IO_L12N_T1_MRCC_16) A9(IO_L14N_T2_SRCC_16) A10(IO_L14P_T2_SRCC_16) A11(IO_L4N_T0_15) A13(IO_L9P_T1_DQS_AD3P_15) A18(IO_L10N_T1_AD11N_15) B8(IO_L12P_T1_MRCC_16) B9(IO_L11N_T1_SRCC_16) B14(IO_L2N_T0_AD8N_15) B16(IO_L7P_T1_AD2P_15) B17(IO_L7N_T1_AD2N_15) C9(IO_L11P_T1_SRCC_16) C10(IO_L13N_T2_MRCC_16) C11(IO_L13P_T2_MRCC_16) C12(IO_L3P_T0_DQS_AD1P_15) C14(IO_L1N_T0_AD0N_15) C15(IO_L12N_T1_MRCC_15) C16(IO_L20P_T3_A20_15) D9(IO_L6N_T0_VREF_16) D10(IO_L19N_T3_VREF_16) D12(IO_L6P_T0_15) D13(IO_L6N_T0_VREF_15) D14(IO_L1P_T0_AD0P_15) D15(IO_L12P_T1_MRCC_15) D17(IO_L16N_T2_A27_15) E15(IO_L11P_T1_SRCC_15) F13(IO_L5P_T0_AD9P_15) F14(IO_L5N_T0_AD9N_15) F15(IO_L14P_T2_SRCC_15) F16(IO_L14N_T2_SRCC_15) G13(IO_0_15) G14(IO_L15N_T2_DQS_ADV_B_15) H14(IO_L15P_T2_DQS_15) H17(IO_L18P_T2_A24_15) J13(IO_L17N_T2_A25_15) J14(IO_L19P_T3_A22_15) J15(IO_L24N_T3_RS0_15) J18(IO_L23N_T3_FWE_B_15) K13(IO_L17P_T2_A26_15) K15(IO_L24P_T3_RS1_15) K16(IO_25_15) L15(IO_L3P_T0_DQS_PUDC_B_14) L16(IO_L3N_T0_DQS_EMCCLK_14) L18(IO_L4P_T0_D04_14) M13(IO_L6N_T0_D08_VREF_14) M16(IO_L10P_T1_D14_14) M17(IO_L10N_T1_D15_14) M18(IO_L4N_T0_D05_14) N14(IO_L8P_T1_D11_14) N15(IO_L11P_T1_SRCC_14) N16(IO_L11N_T1_SRCC_14) N17(IO_L9P_T1_DQS_14) P14(IO_L8N_T1_D12_14) P15(IO_L13P_T2_MRCC_14) P17(IO_L12P_T1_MRCC_14) P18(IO_L9N_T1_DQS_D13_14) R10(IO_25_14) R11(IO_0_14) R12(IO_L5P_T0_D06_14) R13(IO_L5N_T0_D07_14) R15(IO_L13N_T2_MRCC_14) R16(IO_L15P_T2_DQS_RDWR_B_14) R18(IO_L7P_T1_D09_14) T9(IO_L24P_T3_A01_D17_14) T10(IO_L24N_T3_A00_D16_14) T11(IO_L19P_T3_A10_D26_14) T13(IO_L23P_T3_A03_D19_14) T14(IO_L14P_T2_SRCC_14) T15(IO_L14N_T2_SRCC_14) T16(IO_L15N_T2_DQS_DOUT_CSO_B_14) T18(IO_L7N_T1_D10_14) U11(IO_L19N_T3_A09_D25_VREF_14) U12(IO_L20P_T3_A08_D24_14) U13(IO_L23N_T3_A02_D18_14) U14(IO_L22P_T3_A05_D21_14) U16(IO_L18P_T2_A12_D28_14) U17(IO_L17P_T2_A14_D30_14) U18(IO_L17N_T2_A13_D29_14) V10(IO_L21P_T3_DQS_14) V11(IO_L21N_T3_DQS_A06_D22_14) V12(IO_L20N_T3_A07_D23_14) V14(IO_L22N_T3_A04_D20_14) V15(IO_L16P_T2_CSI_B_14) V16(IO_L16N_T2_A15_D31_14) V17(IO_L18N_T2_A11_D27_14)

### Notes on the sheet
- (in symbol XC7A100T-2CSG324I, part A) BANK 14
- (in symbol XC7A100T-2CSG324I, part B) BANK 15
- (in symbol XC7A100T-2CSG324I, part C) BANK 16

### Library data of the parts
C100 = CAP_0201: Capacitor SMD 0201; Manufacturer: *; Manufacturer Part Number: *; Distributor Link: *; LCSC: *; Rating: *; Dielectric: *
FB3 = IND_0201: as FB1 on sheet FPGADecoupling; Datasheet Link: https://psearch.en.murata.com/inductor/product/LQP03HQ56NH02%23.html; Height: 0.42mm; Mouser Part Number: 81-LQP03HQ56NH02D; Mouser Price/Stock: https://www.mouser.co.uk/ProductDetail/Murata-Electronics/LQP03HQ56NH02D?qs=B6kkDfuK7%2FBQu1Ob9%2FT2Bg%3D%3D
IC4 = XC7A100T-2CSG324I: as IC4 on sheet FPGADecoupling; ComponentLink1Description: Datasheet; ComponentLink3Description: DC and Switching Characteristics; Generic Part Number: XC7A100T; RoHS: Pb-Free; Mounting Technology: Surface Mount; PackageReference: CSG324; ComponentLink4URL: http://www.xilinx.com/support/packagefiles/a7packages/xc7a100tcsg324pkg.txt; NexusDeviceID: XC7A100T-2CSG324I; PackageVersion: Rev 1.8; PartNumber: XC7A100T-2CSG324I; CLBs (Max Distributed RAM Kb): 1188; Code_JEDEC: MO-275-KKAC-1; ComponentLink2Description: Package Specification; ComponentLink1URL: http://www.xilinx.com/support/documentation/data_sheets/ds180_7Series_Overview.pdf; ComponentLink3URL: http://www.xilinx.com/support/documentation/data_sheets/ds181_Artix_7_Data_Sheet.pdf; ComponentLink5URL: http://www.xilinx.com/support/documentation/user_guides/ug475_7Series_Pkg_Pinout.pdf; PackageDescription: Wire-Bond Chip-Scale BGA, Body 15 x 15 mm, 0.8 mm Pitch; ComponentLink4Description: Package File; DatasheetVersion: v1.12; ComponentLink2URL: http://www.xilinx.com/support/documentation/user_guides/ug475_7Series_Pkg_Pinout.pdf; ComponentLink5Description: Packaging and Pinout
R35 = RES_0201: Resistor SMD 0201; Manufacturer: *; Manufacturer Part Number: *; Distributor Link: *; LCSC: *
X3 = ECS-2520MV-130-BN-TR: as X2 on sheet USBULPI; Manufacturer Part Number: ECS-2520MV-130-BN-TR

## Sheet FPGABank3X.SchDoc
size A4; SheetNumber: 7; SheetTotal: 10
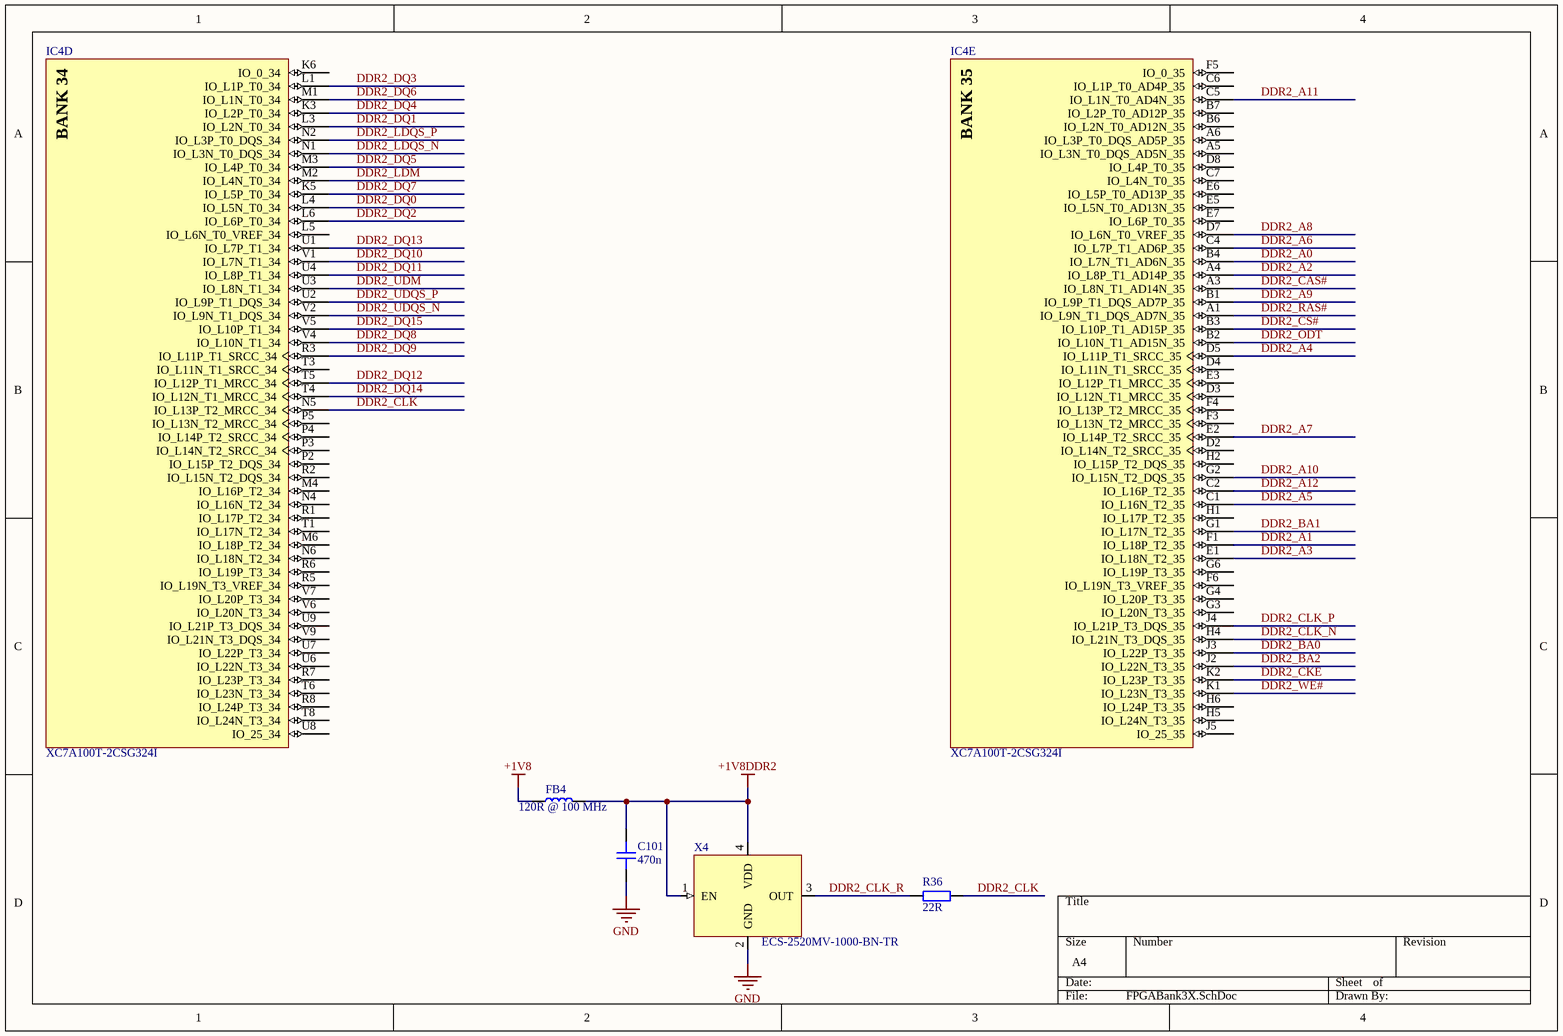
[diagram p7: FPGABank3X.SchDoc]

### Parts
C101  470n  [CAP_0201]
FB4  120R @ 100 MHz  [IND_0201]
IC4  XC7A100T-2CSG324I  [CSG324]  (parts D,E of 9)
R36  22R  [RES_0201]
X4  ECS-2520MV-1000-BN-TR  [XTAL_2520]

### Nets
+1V8: FB4.1
+1V8DDR2: C101.2 FB4.2 X4.1(EN) X4.4(VDD)
GND: C101.1 X4.2(GND)
DDR2_A0: IC4.B4(IO_L7N_T1_AD6N_35)
DDR2_A1: IC4.F1(IO_L18P_T2_35)
DDR2_A2: IC4.A4(IO_L8P_T1_AD14P_35)
DDR2_A3: IC4.E1(IO_L18N_T2_35)
DDR2_A4: IC4.D5(IO_L11P_T1_SRCC_35)
DDR2_A5: IC4.C1(IO_L16N_T2_35)
DDR2_A6: IC4.C4(IO_L7P_T1_AD6P_35)
DDR2_A7: IC4.E2(IO_L14P_T2_SRCC_35)
DDR2_A8: IC4.D7(IO_L6N_T0_VREF_35)
DDR2_A9: IC4.B1(IO_L9P_T1_DQS_AD7P_35)
DDR2_A10: IC4.G2(IO_L15N_T2_DQS_35)
DDR2_A11: IC4.C5(IO_L1N_T0_AD4N_35)
DDR2_A12: IC4.C2(IO_L16P_T2_35)
DDR2_BA0: IC4.J3(IO_L22P_T3_35)
DDR2_BA1: IC4.G1(IO_L17N_T2_35)
DDR2_BA2: IC4.J2(IO_L22N_T3_35)
DDR2_CAS#: IC4.A3(IO_L8N_T1_AD14N_35)
DDR2_CKE: IC4.K2(IO_L23P_T3_35)
DDR2_CLK: IC4.N5(IO_L13P_T2_MRCC_34) R36.2
DDR2_CLK_N: IC4.H4(IO_L21N_T3_DQS_35)
DDR2_CLK_P: IC4.J4(IO_L21P_T3_DQS_35)
DDR2_CLK_R: R36.1 X4.3(OUT)
DDR2_CS#: IC4.B3(IO_L10P_T1_AD15P_35)
DDR2_DQ0: IC4.L4(IO_L5N_T0_34)
DDR2_DQ1: IC4.L3(IO_L2N_T0_34)
DDR2_DQ2: IC4.L6(IO_L6P_T0_34)
DDR2_DQ3: IC4.L1(IO_L1P_T0_34)
DDR2_DQ4: IC4.K3(IO_L2P_T0_34)
DDR2_DQ5: IC4.M3(IO_L4P_T0_34)
DDR2_DQ6: IC4.M1(IO_L1N_T0_34)
DDR2_DQ7: IC4.K5(IO_L5P_T0_34)
DDR2_DQ8: IC4.V4(IO_L10N_T1_34)
DDR2_DQ9: IC4.R3(IO_L11P_T1_SRCC_34)
DDR2_DQ10: IC4.V1(IO_L7N_T1_34)
DDR2_DQ11: IC4.U4(IO_L8P_T1_34)
DDR2_DQ12: IC4.T5(IO_L12P_T1_MRCC_34)
DDR2_DQ13: IC4.U1(IO_L7P_T1_34)
DDR2_DQ14: IC4.T4(IO_L12N_T1_MRCC_34)
DDR2_DQ15: IC4.V5(IO_L10P_T1_34)
DDR2_LDM: IC4.M2(IO_L4N_T0_34)
DDR2_LDQS_N: IC4.N1(IO_L3N_T0_DQS_34)
DDR2_LDQS_P: IC4.N2(IO_L3P_T0_DQS_34)
DDR2_ODT: IC4.B2(IO_L10N_T1_AD15N_35)
DDR2_RAS#: IC4.A1(IO_L9N_T1_DQS_AD7N_35)
DDR2_UDM: IC4.U3(IO_L8N_T1_34)
DDR2_UDQS_N: IC4.V2(IO_L9N_T1_DQS_34)
DDR2_UDQS_P: IC4.U2(IO_L9P_T1_DQS_34)
DDR2_WE#: IC4.K1(IO_L23N_T3_35)

Not connected (* = marked no-connect by the designer): IC4 A5(IO_L3N_T0_DQS_AD5N_35) A6(IO_L3P_T0_DQS_AD5P_35) B6(IO_L2N_T0_AD12N_35) B7(IO_L2P_T0_AD12P_35) C6(IO_L1P_T0_AD4P_35) C7(IO_L4N_T0_35) D2(IO_L14N_T2_SRCC_35) D3(IO_L12N_T1_MRCC_35) D4(IO_L11N_T1_SRCC_35) D8(IO_L4P_T0_35) E3(IO_L12P_T1_MRCC_35) E5(IO_L5N_T0_AD13N_35) E6(IO_L5P_T0_AD13P_35) E7(IO_L6P_T0_35) F3(IO_L13N_T2_MRCC_35) F4(IO_L13P_T2_MRCC_35) F5(IO_0_35) F6(IO_L19N_T3_VREF_35) G3(IO_L20N_T3_35) G4(IO_L20P_T3_35) G6(IO_L19P_T3_35) H1(IO_L17P_T2_35) H2(IO_L15P_T2_DQS_35) H5(IO_L24N_T3_35) H6(IO_L24P_T3_35) J5(IO_25_35) K6(IO_0_34) L5(IO_L6N_T0_VREF_34) M4(IO_L16P_T2_34) M6(IO_L18P_T2_34) N4(IO_L16N_T2_34) N6(IO_L18N_T2_34) P2(IO_L15P_T2_DQS_34) P3(IO_L14N_T2_SRCC_34) P4(IO_L14P_T2_SRCC_34) P5(IO_L13N_T2_MRCC_34) R1(IO_L17P_T2_34) R2(IO_L15N_T2_DQS_34) R5(IO_L19N_T3_VREF_34) R6(IO_L19P_T3_34) R7(IO_L23P_T3_34) R8(IO_L24P_T3_34) T1(IO_L17N_T2_34) T3(IO_L11N_T1_SRCC_34) T6(IO_L23N_T3_34) T8(IO_L24N_T3_34) U6(IO_L22N_T3_34) U7(IO_L22P_T3_34) U8(IO_25_34) U9(IO_L21P_T3_DQS_34) V6(IO_L20N_T3_34) V7(IO_L20P_T3_34) V9(IO_L21N_T3_DQS_34)

### Notes on the sheet
- (in symbol XC7A100T-2CSG324I, part D) BANK 34
- (in symbol XC7A100T-2CSG324I, part E) BANK 35

### Library data of the parts
C101 = CAP_0201: Capacitor SMD 0201; Manufacturer: *; Manufacturer Part Number: *; Distributor Link: *; LCSC: *; Rating: *; Dielectric: *
FB4 = IND_0201: as FB1 on sheet FPGADecoupling; Datasheet Link: https://psearch.en.murata.com/inductor/product/LQP03HQ56NH02%23.html; Height: 0.42mm; Mouser Part Number: 81-LQP03HQ56NH02D; Mouser Price/Stock: https://www.mouser.co.uk/ProductDetail/Murata-Electronics/LQP03HQ56NH02D?qs=B6kkDfuK7%2FBQu1Ob9%2FT2Bg%3D%3D
IC4 = XC7A100T-2CSG324I: as IC4 on sheet FPGADecoupling; ComponentLink1Description: Datasheet; ComponentLink3Description: DC and Switching Characteristics; Generic Part Number: XC7A100T; RoHS: Pb-Free; Mounting Technology: Surface Mount; PackageReference: CSG324; ComponentLink4URL: http://www.xilinx.com/support/packagefiles/a7packages/xc7a100tcsg324pkg.txt; NexusDeviceID: XC7A100T-2CSG324I; PackageVersion: Rev 1.8; PartNumber: XC7A100T-2CSG324I; CLBs (Max Distributed RAM Kb): 1188; Code_JEDEC: MO-275-KKAC-1; ComponentLink2Description: Package Specification; ComponentLink1URL: http://www.xilinx.com/support/documentation/data_sheets/ds180_7Series_Overview.pdf; ComponentLink3URL: http://www.xilinx.com/support/documentation/data_sheets/ds181_Artix_7_Data_Sheet.pdf; ComponentLink5URL: http://www.xilinx.com/support/documentation/user_guides/ug475_7Series_Pkg_Pinout.pdf; PackageDescription: Wire-Bond Chip-Scale BGA, Body 15 x 15 mm, 0.8 mm Pitch; ComponentLink4Description: Package File; DatasheetVersion: v1.12; ComponentLink2URL: http://www.xilinx.com/support/documentation/user_guides/ug475_7Series_Pkg_Pinout.pdf; ComponentLink5Description: Packaging and Pinout
R36 = RES_0201: Resistor SMD 0201; Manufacturer: *; Manufacturer Part Number: *; Distributor Link: *; LCSC: *
X4 = ECS-2520MV-130-BN-TR: as X2 on sheet USBULPI; Manufacturer Part Number: ECS-2520MV-130-BN-TR

## Sheet DDR2Module.SchDoc
size A4; SheetNumber: 8; SheetTotal: 10
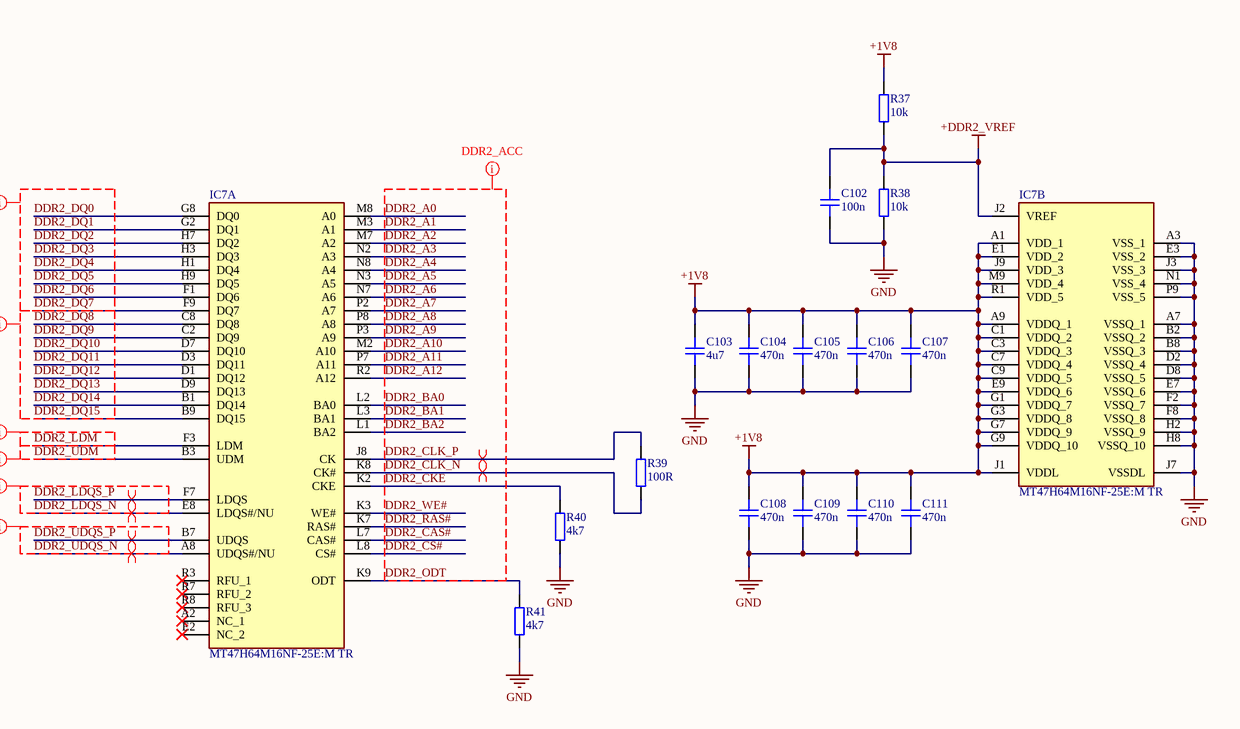
[diagram p8: DDR2Module.SchDoc]

### Parts
C102  100n  [CAP_0402]
C103  4u7  [CAP_0402]
C104  470n  [CAP_0201]
C105  470n  [CAP_0201]
C106  470n  [CAP_0201]
C107  470n  [CAP_0201]
C108  470n  [CAP_0201]
C109  470n  [CAP_0201]
C110  470n  [CAP_0201]
C111  470n  [CAP_0201]
IC7  MT47H64M16NF-25E:M TR  [BGA84C80P9X15_800X1250X120]  (parts A,B of 2)
R37  10k  [RES_0402]
R38  10k  [RES_0402]
R39  100R  [RES_0201]
R40  4k7  [RES_0201]
R41  4k7  [RES_0201]

### Nets
+1V8: C103.2 C104.2 C105.2 C106.2 C107.2 C108.2 C109.2 C110.2 C111.2 IC7.A1(VDD_1) IC7.A9(VDDQ_1) IC7.C1(VDDQ_2) IC7.C3(VDDQ_3) IC7.C7(VDDQ_4) IC7.C9(VDDQ_5) IC7.E1(VDD_2) IC7.E9(VDDQ_6) IC7.G1(VDDQ_7) IC7.G3(VDDQ_8) IC7.G7(VDDQ_9) IC7.G9(VDDQ_10) IC7.J1(VDDL) IC7.J9(VDD_3) IC7.M9(VDD_4) IC7.R1(VDD_5) R37.2
+DDR2_VREF: C102.1 IC7.J2(VREF) R37.1 R38.2
GND: C102.2 C103.1 C104.1 C105.1 C106.1 C107.1 C108.1 C109.1 C110.1 C111.1 IC7.A3(VSS_1) IC7.A7(VSSQ_1) IC7.B2(VSSQ_2) IC7.B8(VSSQ_3) IC7.D2(VSSQ_4) IC7.D8(VSSQ_5) IC7.E3(VSS_2) IC7.E7(VSSQ_6) IC7.F2(VSSQ_7) IC7.F8(VSSQ_8) IC7.H2(VSSQ_9) IC7.H8(VSSQ_10) IC7.J3(VSS_3) IC7.J7(VSSDL) IC7.N1(VSS_4) IC7.P9(VSS_5) R38.1 R40.1 R41.1
DDR2_A0: IC7.M8(A0)
DDR2_A1: IC7.M3(A1)
DDR2_A2: IC7.M7(A2)
DDR2_A3: IC7.N2(A3)
DDR2_A4: IC7.N8(A4)
DDR2_A5: IC7.N3(A5)
DDR2_A6: IC7.N7(A6)
DDR2_A7: IC7.P2(A7)
DDR2_A8: IC7.P8(A8)
DDR2_A9: IC7.P3(A9)
DDR2_A10: IC7.M2(A10)
DDR2_A11: IC7.P7(A11)
DDR2_A12: IC7.R2(A12)
DDR2_BA0: IC7.L2(BA0)
DDR2_BA1: IC7.L3(BA1)
DDR2_BA2: IC7.L1(BA2)
DDR2_CAS#: IC7.L7(CAS#)
DDR2_CKE: IC7.K2(CKE) R40.2
DDR2_CLK_N: IC7.K8(CK#) R39.1
DDR2_CLK_P: IC7.J8(CK) R39.2
DDR2_CS#: IC7.L8(CS#)
DDR2_DQ0: IC7.G8(DQ0)
DDR2_DQ1: IC7.G2(DQ1)
DDR2_DQ2: IC7.H7(DQ2)
DDR2_DQ3: IC7.H3(DQ3)
DDR2_DQ4: IC7.H1(DQ4)
DDR2_DQ5: IC7.H9(DQ5)
DDR2_DQ6: IC7.F1(DQ6)
DDR2_DQ7: IC7.F9(DQ7)
DDR2_DQ8: IC7.C8(DQ8)
DDR2_DQ9: IC7.C2(DQ9)
DDR2_DQ10: IC7.D7(DQ10)
DDR2_DQ11: IC7.D3(DQ11)
DDR2_DQ12: IC7.D1(DQ12)
DDR2_DQ13: IC7.D9(DQ13)
DDR2_DQ14: IC7.B1(DQ14)
DDR2_DQ15: IC7.B9(DQ15)
DDR2_LDM: IC7.F3(LDM)
DDR2_LDQS_N: IC7.E8(LDQS#/NU)
DDR2_LDQS_P: IC7.F7(LDQS)
DDR2_ODT: IC7.K9(ODT) R41.2
DDR2_RAS#: IC7.K7(RAS#)
DDR2_UDM: IC7.B3(UDM)
DDR2_UDQS_N: IC7.A8(UDQS#/NU)
DDR2_UDQS_P: IC7.B7(UDQS)
DDR2_WE#: IC7.K3(WE#)

Not connected (* = marked no-connect by the designer): IC7 A2(NC_1)* E2(NC_2)* R3(RFU_1)* R7(RFU_2)* R8(RFU_3)*

### Layout directives
differential pair: DDR2_CLK_N, DDR2_CLK_P, DDR2_LDQS_N, DDR2_LDQS_P, DDR2_UDQS_N, DDR2_UDQS_P
mark named DDR2_BL0: DDR2_DQ0, DDR2_DQ1, DDR2_DQ2, DDR2_DQ3, DDR2_DQ4, DDR2_DQ5, DDR2_DQ6, DDR2_DQ7, DDR2_LDM, DDR2_LDQS_N, DDR2_LDQS_P
mark named DDR2_ACC: DDR2_A0, DDR2_A1, DDR2_A2, DDR2_A3, DDR2_A4, DDR2_A5, DDR2_A6, DDR2_A7, DDR2_A8, DDR2_A9, DDR2_A10, DDR2_A11, DDR2_A12, DDR2_BA0, DDR2_BA1, DDR2_BA2, DDR2_CAS#, DDR2_CKE, DDR2_CLK_N, DDR2_CLK_P, DDR2_CS#, DDR2_ODT, DDR2_RAS#, DDR2_WE#
mark named DDR2_BL1: DDR2_DQ7, DDR2_DQ8, DDR2_DQ9, DDR2_DQ10, DDR2_DQ11, DDR2_DQ12, DDR2_DQ13, DDR2_DQ14, DDR2_DQ15, DDR2_LDM, DDR2_UDM, DDR2_UDQS_N, DDR2_UDQS_P

### Library data of the parts
C102 C103 = CAP_0402: Capacitor SMD 0402; Manufacturer: *; Manufacturer Part Number: *; Distributor Link: *; LCSC: *; Rating: *; Dielectric: *
C104-C111 = CAP_0201: Capacitor SMD 0201; Manufacturer: *; Manufacturer Part Number: *; Distributor Link: *; LCSC: *; Rating: *; Dielectric: *
IC7 = MT47H64M16NF-25E:M TR: Integrated Circuit; Manufacturer_Name: Micron; Datasheet Link: https://www.micron.com/-/media/client/global/documents/products/data-sheet/dram/ddr2/1gb_ddr2.pdf; Height: 1.2mm; Manufacturer_Part_Number: MT47H64M16NF-25E:M TR; Mouser Part Number: 340-248361-REEL; Mouser Price/Stock: https://www.mouser.co.uk/ProductDetail/Micron/MT47H64M16NF-25EM-TR?qs=taEdVNyAfdEAmKNgRBNaGQ%3D%3D; Arrow Part Number: MT47H64M16NF-25E:M TR; Arrow Price/Stock: https://www.arrow.com/en/products/mt47h64m16nf-25em-tr/micron-technology?region=europe
R37 R38 = RES_0402: Resistor SMD 0402; Manufacturer: *; Manufacturer Part Number: *; Distributor Link: *; LCSC: *
R39-R41 = RES_0201: Resistor SMD 0201; Manufacturer: *; Manufacturer Part Number: *; Distributor Link: *; LCSC: *

## Sheet AudioADC.SchDoc
size A4; SheetNumber: 9; SheetTotal: 10
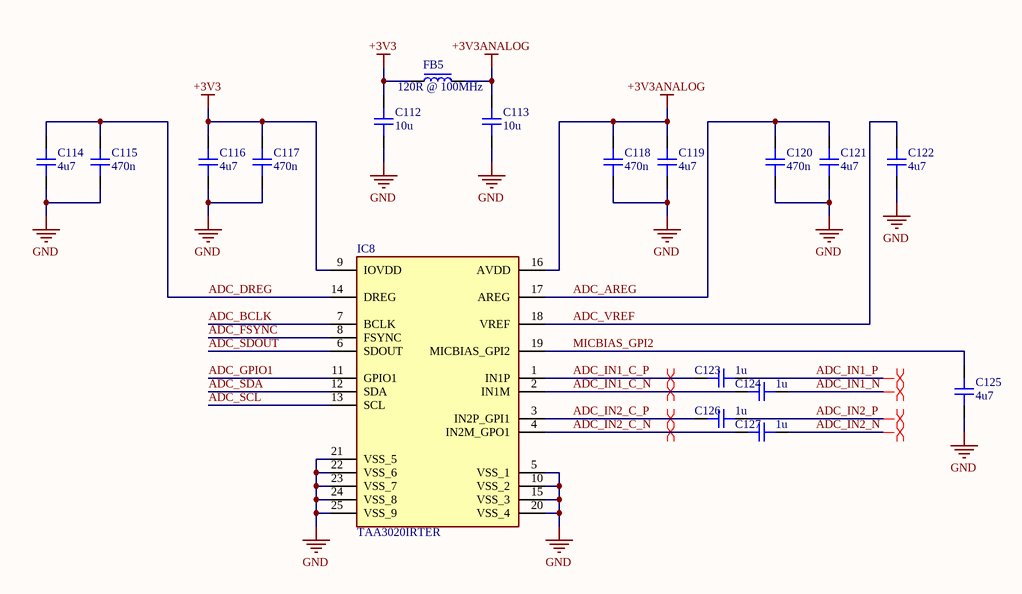
[diagram p9: AudioADC.SchDoc]

### Parts
C112  10u  [CAP_0805]
C113  10u  [CAP_0805]
C114  4u7  [CAP_0402]
C115  470n  [CAP_0201]
C116  4u7  [CAP_0402]
C117  470n  [CAP_0201]
C118  470n  [CAP_0201]
C119  4u7  [CAP_0402]
C120  470n  [CAP_0201]
C121  4u7  [CAP_0402]
C122  4u7  [CAP_0402]
C123  1u  [CAP_0402]
C124  1u  [CAP_0402]
C125  4u7  [CAP_0402]
C126  1u  [CAP_0402]
C127  1u  [CAP_0402]
FB5  120R @ 100MHz  [FB_0805]
IC8  TAA3020IRTER  [PCM1820IRTER]

### Nets
+3V3: C112.2 C116.2 C117.2 FB5.1 IC8.9(IOVDD)
+3V3ANALOG: C113.2 C118.2 C119.2 FB5.2 IC8.16(AVDD)
GND: C112.1 C113.1 C114.1 C115.1 C116.1 C117.1 C118.1 C119.1 C120.1 C121.1 C122.1 C125.1 IC8.5(VSS_1) IC8.10(VSS_2) IC8.15(VSS_3) IC8.20(VSS_4) IC8.21(VSS_5) IC8.22(VSS_6) IC8.23(VSS_7) IC8.24(VSS_8) IC8.25(VSS_9)
ADC_AREG: C120.2 C121.2 IC8.17(AREG)
ADC_BCLK: IC8.7(BCLK)
ADC_DREG: C114.2 C115.2 IC8.14(DREG)
ADC_FSYNC: IC8.8(FSYNC)
ADC_GPIO1: IC8.11(GPIO1)
ADC_IN1_C_N: C124.1 IC8.2(IN1M)
ADC_IN1_C_P: C123.1 IC8.1(IN1P)
ADC_IN1_N: C124.2
ADC_IN1_P: C123.2
ADC_IN2_C_N: C127.1 IC8.4(IN2M_GPO1)
ADC_IN2_C_P: C126.1 IC8.3(IN2P_GPI1)
ADC_IN2_N: C127.2
ADC_IN2_P: C126.2
ADC_SCL: IC8.13(SCL)
ADC_SDA: IC8.12(SDA)
ADC_SDOUT: IC8.6(SDOUT)
ADC_VREF: C122.2 IC8.18(VREF)
MICBIAS_GPI2: C125.2 IC8.19(MICBIAS_GPI2)

### Layout directives
differential pair: ADC_IN1_C_N, ADC_IN1_C_P, ADC_IN1_N, ADC_IN1_P, ADC_IN2_C_N, ADC_IN2_C_P, ADC_IN2_N, ADC_IN2_P

### Library data of the parts
C112 C113 = CAP_0805: Capacitor SMD 0805; Manufacturer: *; Manufacturer Part Number: *; Distributor Link: *; LCSC: *; Rating: *; Dielectric: *
C114 C116 C119 C121-C127 = CAP_0402: Capacitor SMD 0402; Manufacturer: *; Manufacturer Part Number: *; Distributor Link: *; LCSC: *; Rating: *; Dielectric: *
C115 C117 C118 C120 = CAP_0201: Capacitor SMD 0201; Manufacturer: *; Manufacturer Part Number: *; Distributor Link: *; LCSC: *; Rating: *; Dielectric: *
FB5 = FB_0805: Ferrite Bead SMD 0805; Manufacturer: *; Manufacturer Part Number: *; Distributor Link: *; LCSC: *
IC8 = TAA3020IRTER: Integrated Circuit; Manufacturer_Name: Texas Instruments; Datasheet Link: https://www.ti.com/lit/ds/symlink/taa3020.pdf?ts=1735147381281&ref_url=https%253A%252F%252Fwww.ti.com%252Fproduct%252FTAA3020; Height: 0.8mm; Manufacturer_Part_Number: TAA3020IRTER

## Sheet AnalogFrontend.SchDoc
size A4; SheetNumber: 10; SheetTotal: 10
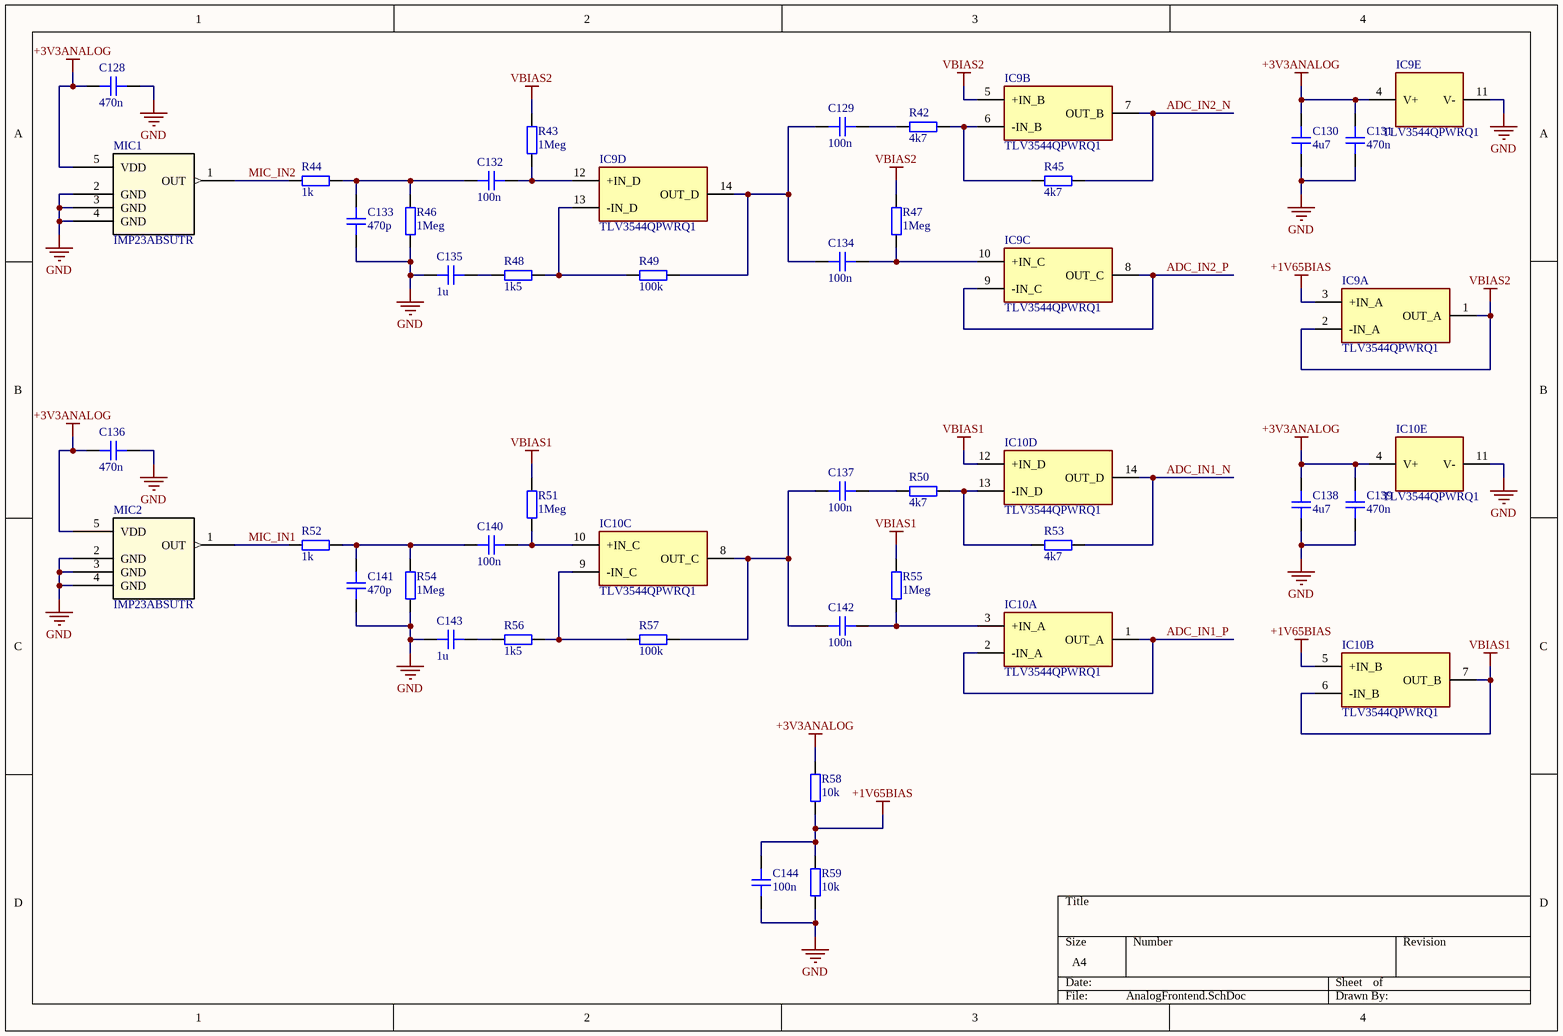
[diagram p10: AnalogFrontend.SchDoc]

### Parts
C128  470n  [CAP_0201]
C129  100n  [CAP_0402]
C130  4u7  [CAP_0402]
C131  470n  [CAP_0201]
C132  100n  [CAP_0402]
C133  470p  [CAP_0402]
C134  100n  [CAP_0402]
C135  1u  [CAP_0402]
C136  470n  [CAP_0201]
C137  100n  [CAP_0402]
C138  4u7  [CAP_0402]
C139  470n  [CAP_0201]
C140  100n  [CAP_0402]
C141  470p  [CAP_0402]
C142  100n  [CAP_0402]
C143  1u  [CAP_0402]
C144  100n  [CAP_0402]
IC9  TLV3544QPWRQ1  [SOP65P640X120-14N]  (parts A,B,C,D,E of 5)
IC10  TLV3544QPWRQ1  [SOP65P640X120-14N]  (parts A,B,C,D,E of 5)
MIC1  IMP23ABSUTR  [RHLGA5_3P5X2P65X0P98_STM]
MIC2  IMP23ABSUTR  [RHLGA5_3P5X2P65X0P98_STM]
R42  4k7  [RES_0402]
R43  1Meg  [RES_0402]
R44  1k  [RES_0402]
R45  4k7  [RES_0402]
R46  1Meg  [RES_0402]
R47  1Meg  [RES_0402]
R48  1k5  [RES_0402]
R49  100k  [RES_0402]
R50  4k7  [RES_0402]
R51  1Meg  [RES_0402]
R52  1k  [RES_0402]
R53  4k7  [RES_0402]
R54  1Meg  [RES_0402]
R55  1Meg  [RES_0402]
R56  1k5  [RES_0402]
R57  100k  [RES_0402]
R58  10k  [RES_0402]
R59  10k  [RES_0402]

### Nets
+1V65BIAS: C144.1 IC9.3(+IN_A) IC10.5(+IN_B) R58.1 R59.2
+3V3ANALOG: C128.2 C130.2 C131.2 C136.2 C138.2 C139.2 IC9.4(V+) IC10.4(V+) MIC1.5(VDD) MIC2.5(VDD) R58.2
GND: C128.1 C130.1 C131.1 C133.2 C135.1 C136.1 C138.1 C139.1 C141.2 C143.1 C144.2 IC9.11(V-) IC10.11(V-) MIC1.2(GND) MIC1.3(GND) MIC1.4(GND) MIC2.2(GND) MIC2.3(GND) MIC2.4(GND) R46.1 R54.1 R59.1
VBIAS1: IC10.6(-IN_B) IC10.7(OUT_B) IC10.12(+IN_D) R51.2 R55.2
VBIAS2: IC9.1(OUT_A) IC9.2(-IN_A) IC9.5(+IN_B) R43.2 R47.2
ADC_IN1_N: IC10.14(OUT_D) R53.2
ADC_IN1_P: IC10.1(OUT_A) IC10.2(-IN_A)
ADC_IN2_N: IC9.7(OUT_B) R45.2
ADC_IN2_P: IC9.8(OUT_C) IC9.9(-IN_C)
MIC_IN1: MIC2.1(OUT) R52.2
MIC_IN2: MIC1.1(OUT) R44.2
NetC129_1: C129.1 R42.1
NetC129_2: C129.2 C134.2 IC9.14(OUT_D) R49.2
NetC132_1: C132.1 IC9.12(+IN_D) R43.1
NetC132_2: C132.2 C133.1 R44.1 R46.2
NetC134_1: C134.1 IC9.10(+IN_C) R47.1
NetC135_2: C135.2 R48.1
NetC137_1: C137.1 R50.1
NetC137_2: C137.2 C142.2 IC10.8(OUT_C) R57.2
NetC140_1: C140.1 IC10.10(+IN_C) R51.1
NetC140_2: C140.2 C141.1 R52.1 R54.2
NetC142_1: C142.1 IC10.3(+IN_A) R55.1
NetC143_2: C143.2 R56.1
NetIC9_6: IC9.6(-IN_B) R42.2 R45.1
NetIC9_13: IC9.13(-IN_D) R48.2 R49.1
NetIC10_9: IC10.9(-IN_C) R56.2 R57.1
NetIC10_13: IC10.13(-IN_D) R50.2 R53.1

### Library data of the parts
C128 C131 C136 C139 = CAP_0201: Capacitor SMD 0201; Manufacturer: *; Manufacturer Part Number: *; Distributor Link: *; LCSC: *; Rating: *; Dielectric: *
C129 C130 C132-C135 C137 C138 C140-C144 = CAP_0402: Capacitor SMD 0402; Manufacturer: *; Manufacturer Part Number: *; Distributor Link: *; LCSC: *; Rating: *; Dielectric: *
IC9 IC10 = TLV3544QPWRQ1: Integrated Circuit; Manufacturer_Name: Texas Instruments; Datasheet Link: http://www.ti.com/lit/gpn/tlv3544-q1; Height: 1.2mm; Manufacturer_Part_Number: TLV3544QPWRQ1; Mouser Part Number: 595-TLV3544QPWRQ1; Mouser Price/Stock: https://www.mouser.co.uk/ProductDetail/Texas-Instruments/TLV3544QPWRQ1?qs=xhbEVWpZdWeZ7jRiLWDiEw%3D%3D; Arrow Part Number: TLV3544QPWRQ1; Arrow Price/Stock: https://www.arrow.com/en/products/tlv3544qpwrq1/texas-instruments?utm_currency=USD&region=nac
MIC1 MIC2 = IMP23ABSUTR: No Description Available; Mfr_Name: STMicroelectronics; RefDes: RefDes; Type: Type
R42-R59 = RES_0402: Resistor SMD 0402; Manufacturer: *; Manufacturer Part Number: *; Distributor Link: *; LCSC: *

## Nets that join several sheets
+1V0: PowerSupplies (7 pins), FPGADecoupling (35 pins)
+1V8: PowerSupplies (7 pins), FPGADecoupling (40 pins), USBULPI (C94.2 U2.21), FPGABank3X (FB4.1), DDR2Module (26 pins)
+3V3: PowerSupplies (7 pins), FPGADecoupling (36 pins), FPGAConfig (9 pins), FTDIJtagConversion (16 pins), USBULPI (8 pins), FPGABank1X (FB3.1), AudioADC (5 pins)
+3V3ANALOG: AudioADC (5 pins), AnalogFrontend (11 pins)
+5V0: PowerSupplies (13 pins), FTDIJtagConversion (J1.A4 J1.A9)
GND: PowerSupplies (21 pins), FPGADecoupling (112 pins), FPGAConfig (11 pins), FTDIJtagConversion (30 pins), USBULPI (19 pins), FPGABank1X (C100.1 X3.2), FPGABank3X (C101.1 X4.2), DDR2Module (29 pins), AudioADC (21 pins), AnalogFrontend (22 pins)
ADC_BCLK: FPGABank1X (IC4.B12), AudioADC (IC8.7)
ADC_FSYNC: FPGABank1X (IC4.B13), AudioADC (IC8.8)
ADC_GPIO1: FPGABank1X (IC4.A14), AudioADC (IC8.11)
ADC_IN1_N: AudioADC (C124.2), AnalogFrontend (IC10.14 R53.2)
ADC_IN1_P: AudioADC (C123.2), AnalogFrontend (IC10.1 IC10.2)
ADC_IN2_N: AudioADC (C127.2), AnalogFrontend (IC9.7 R45.2)
ADC_IN2_P: AudioADC (C126.2), AnalogFrontend (IC9.8 IC9.9)
ADC_SCL: FPGABank1X (IC4.A16), AudioADC (IC8.13)
ADC_SDA: FPGABank1X (IC4.A15), AudioADC (IC8.12)
ADC_SDOUT: FPGABank1X (IC4.B11), AudioADC (IC8.6)
DDR2_A0: FPGABank3X (IC4.B4), DDR2Module (IC7.M8)
DDR2_A1: FPGABank3X (IC4.F1), DDR2Module (IC7.M3)
DDR2_A2: FPGABank3X (IC4.A4), DDR2Module (IC7.M7)
DDR2_A3: FPGABank3X (IC4.E1), DDR2Module (IC7.N2)
DDR2_A4: FPGABank3X (IC4.D5), DDR2Module (IC7.N8)
DDR2_A5: FPGABank3X (IC4.C1), DDR2Module (IC7.N3)
DDR2_A6: FPGABank3X (IC4.C4), DDR2Module (IC7.N7)
DDR2_A7: FPGABank3X (IC4.E2), DDR2Module (IC7.P2)
DDR2_A8: FPGABank3X (IC4.D7), DDR2Module (IC7.P8)
DDR2_A9: FPGABank3X (IC4.B1), DDR2Module (IC7.P3)
DDR2_A10: FPGABank3X (IC4.G2), DDR2Module (IC7.M2)
DDR2_A11: FPGABank3X (IC4.C5), DDR2Module (IC7.P7)
DDR2_A12: FPGABank3X (IC4.C2), DDR2Module (IC7.R2)
DDR2_BA0: FPGABank3X (IC4.J3), DDR2Module (IC7.L2)
DDR2_BA1: FPGABank3X (IC4.G1), DDR2Module (IC7.L3)
DDR2_BA2: FPGABank3X (IC4.J2), DDR2Module (IC7.L1)
DDR2_CAS#: FPGABank3X (IC4.A3), DDR2Module (IC7.L7)
DDR2_CKE: FPGABank3X (IC4.K2), DDR2Module (IC7.K2 R40.2)
DDR2_CLK_N: FPGABank3X (IC4.H4), DDR2Module (IC7.K8 R39.1)
DDR2_CLK_P: FPGABank3X (IC4.J4), DDR2Module (IC7.J8 R39.2)
DDR2_CS#: FPGABank3X (IC4.B3), DDR2Module (IC7.L8)
DDR2_DQ0: FPGABank3X (IC4.L4), DDR2Module (IC7.G8)
DDR2_DQ1: FPGABank3X (IC4.L3), DDR2Module (IC7.G2)
DDR2_DQ2: FPGABank3X (IC4.L6), DDR2Module (IC7.H7)
DDR2_DQ3: FPGABank3X (IC4.L1), DDR2Module (IC7.H3)
DDR2_DQ4: FPGABank3X (IC4.K3), DDR2Module (IC7.H1)
DDR2_DQ5: FPGABank3X (IC4.M3), DDR2Module (IC7.H9)
DDR2_DQ6: FPGABank3X (IC4.M1), DDR2Module (IC7.F1)
DDR2_DQ7: FPGABank3X (IC4.K5), DDR2Module (IC7.F9)
DDR2_DQ8: FPGABank3X (IC4.V4), DDR2Module (IC7.C8)
DDR2_DQ9: FPGABank3X (IC4.R3), DDR2Module (IC7.C2)
DDR2_DQ10: FPGABank3X (IC4.V1), DDR2Module (IC7.D7)
DDR2_DQ11: FPGABank3X (IC4.U4), DDR2Module (IC7.D3)
DDR2_DQ12: FPGABank3X (IC4.T5), DDR2Module (IC7.D1)
DDR2_DQ13: FPGABank3X (IC4.U1), DDR2Module (IC7.D9)
DDR2_DQ14: FPGABank3X (IC4.T4), DDR2Module (IC7.B1)
DDR2_DQ15: FPGABank3X (IC4.V5), DDR2Module (IC7.B9)
DDR2_LDM: FPGABank3X (IC4.M2), DDR2Module (IC7.F3)
DDR2_LDQS_N: FPGABank3X (IC4.N1), DDR2Module (IC7.E8)
DDR2_LDQS_P: FPGABank3X (IC4.N2), DDR2Module (IC7.F7)
DDR2_ODT: FPGABank3X (IC4.B2), DDR2Module (IC7.K9 R41.2)
DDR2_RAS#: FPGABank3X (IC4.A1), DDR2Module (IC7.K7)
DDR2_UDM: FPGABank3X (IC4.U3), DDR2Module (IC7.B3)
DDR2_UDQS_N: FPGABank3X (IC4.V2), DDR2Module (IC7.A8)
DDR2_UDQS_P: FPGABank3X (IC4.U2), DDR2Module (IC7.B7)
DDR2_WE#: FPGABank3X (IC4.K1), DDR2Module (IC7.K3)
FPGA_TCK: FPGAConfig (IC4.E10), FTDIJtagConversion (R21.1)
FPGA_TDI: FPGAConfig (IC4.E11), FTDIJtagConversion (R22.1)
FPGA_TDO: FPGAConfig (IC4.E13), FTDIJtagConversion (R23.1)
FPGA_TMS: FPGAConfig (IC4.E12), FTDIJtagConversion (R24.1)
QSPI_CS#: FPGAConfig (R18.1 U1.C2), FPGABank1X (IC4.L13)
QSPI_D0: FPGAConfig (U1.D3), FPGABank1X (IC4.K17)
QSPI_D1: FPGAConfig (U1.D2), FPGABank1X (IC4.K18)
QSPI_D2: FPGAConfig (U1.C4), FPGABank1X (IC4.L14)
QSPI_D3: FPGAConfig (U1.D4), FPGABank1X (IC4.M14)
SYS_PG: PowerSupplies (R13.1), FPGAConfig (U1.A4)
ULPI_CLK: USBULPI (U2.12), FPGABank1X (IC4.E17)
ULPI_D0: USBULPI (U2.16), FPGABank1X (IC4.G17)
ULPI_D1: USBULPI (U2.15), FPGABank1X (IC4.F18)
ULPI_D2: USBULPI (U2.14), FPGABank1X (IC4.G16)
ULPI_D3: USBULPI (U2.13), FPGABank1X (IC4.E18)
ULPI_D4: USBULPI (U2.11), FPGABank1X (IC4.E16)
ULPI_D5: USBULPI (U2.10), FPGABank1X (IC4.D18)
ULPI_D6: USBULPI (U2.9), FPGABank1X (IC4.C17)
ULPI_D7: USBULPI (U2.8), FPGABank1X (IC4.B18)
ULPI_DIR: USBULPI (U2.19), FPGABank1X (IC4.H15)
ULPI_NXT: USBULPI (U2.18), FPGABank1X (IC4.G18)
ULPI_STP: USBULPI (U2.20), FPGABank1X (IC4.H16)
USB_NRESET_R: USBULPI (R30.1 U2.22), FPGABank1X (IC4.J17)